# Altium project Wolf-Lite M.PrjPcb (part 1 of 2)
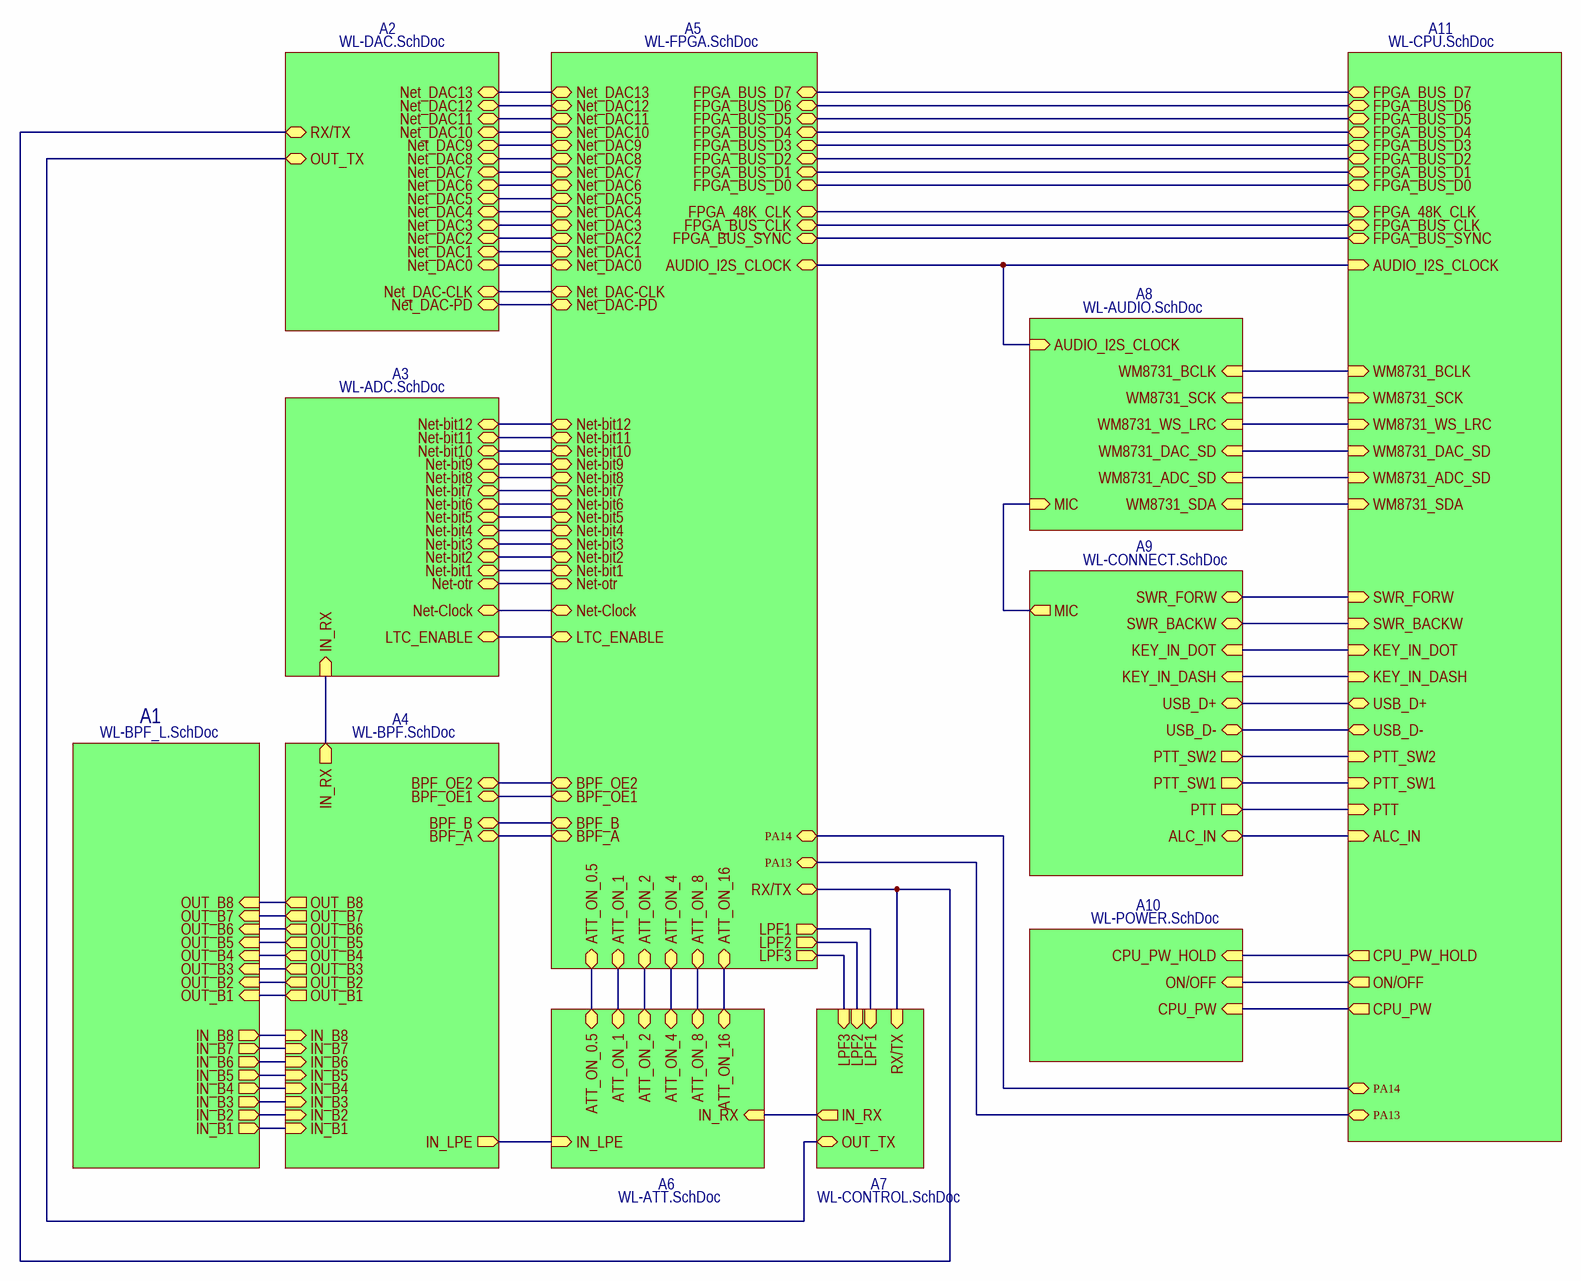
[diagram p0: WL-MAIN.SchDoc]
Обозначение_Код: WOLF LITE M; Обозначение_PCB: WOLF LITE M; Обозначение: WOLF LITE M
12 sheets, 331 parts. Net scope: hierarchical (ports join the sheet entries above them; power ports are global).
Board file: Wolf-Lite M.PcbDoc
Sheets:
  WL-MAIN.SchDoc
    A10 = WL-POWER.SchDoc
    A3 = WL-ADC.SchDoc
    A5 = WL-FPGA.SchDoc
    A2 = WL-DAC.SchDoc
    A6 = WL-ATT.SchDoc
    A11 = WL-CPU.SchDoc
    A8 = WL-AUDIO.SchDoc
    A7 = WL-CONTROL.SchDoc
    A4 = WL-BPF.SchDoc
    A9 = WL-CONNECT.SchDoc
    A1 = WL-BPF_L.SchDoc

## Sheet WL-MAIN.SchDoc
size 420 x 297 mm; Scale: 1:1; DocumentNumber: 1; SheetNumber: 1; SheetTotal: 12

### Sub-sheets
A1 = WL-BPF_L.SchDoc: OUT_B2 (in), OUT_B3 (in), OUT_B4 (in), OUT_B1 (in), IN_B1 (out), IN_B2 (out), IN_B3 (out), IN_B4 (out), OUT_B7 (in), OUT_B6 (in), OUT_B5 (in), IN_B7 (out), IN_B6 (out), IN_B5 (out), IN_B8 (out), OUT_B8 (in)
A2 = WL-DAC.SchDoc: Net_DAC13 (bidir), Net_DAC2 (bidir), Net_DAC3 (bidir), Net_DAC1 (bidir), Net_DAC0 (bidir), Net_DAC-CLK (bidir), Net_DAC4 (bidir), Net_DAC7 (bidir), Net_DAC10 (bidir), Net_DAC5 (bidir), Net_DAC6 (bidir), Net_DAC11 (bidir), Net_DAC12 (bidir), Net_DAC8 (bidir), Net_DAC9 (bidir), OUT_TX (bidir), Net_DAC-PD (bidir), RX/TX (bidir)
A3 = WL-ADC.SchDoc: Net-bit7 (bidir), Net-bit2 (bidir), Net-bit10 (bidir), Net-bit6 (bidir), Net-bit4 (bidir), Net-bit3 (bidir), Net-bit1 (bidir), Net-bit5 (bidir), Net-bit9 (bidir), Net-otr (bidir), Net-bit8 (bidir), Net-bit11 (bidir), Net-Clock (bidir), Net-bit12 (bidir), LTC_ENABLE (bidir), IN_RX (in)
A4 = WL-BPF.SchDoc: IN_RX (out), BPF_OE2 (bidir), BPF_A (bidir), BPF_B (bidir), BPF_OE1 (bidir), OUT_B8 (out), OUT_B7 (out), OUT_B6 (out), OUT_B5 (out), OUT_B4 (out), OUT_B3 (out), OUT_B2 (out), OUT_B1 (out), IN_B1 (in), IN_B2 (in), IN_B3 (in), IN_B4 (in), IN_B5 (in), IN_B6 (in), IN_B7 (in), IN_B8 (in), IN_LPE (out)
A5 = WL-FPGA.SchDoc: FPGA_BUS_D5 (bidir), FPGA_BUS_D2 (bidir), FPGA_BUS_D7 (bidir), AUDIO_I2S_CLOCK (bidir), FPGA_BUS_D4 (bidir), FPGA_BUS_D1 (bidir), FPGA_48K_CLK (bidir), FPGA_BUS_D6 (bidir), FPGA_BUS_D3 (bidir), FPGA_BUS_D0 (bidir), FPGA_BUS_CLK (bidir), FPGA_BUS_SYNC (bidir), ATT_ON_0.5 (bidir), ATT_ON_1 (bidir), ATT_ON_2 (bidir), ATT_ON_4 (bidir), ATT_ON_8 (bidir), ATT_ON_16 (bidir), Net_DAC13 (bidir), Net_DAC2 (bidir), Net_DAC3 (bidir), Net_DAC1 (bidir), Net_DAC0 (bidir), Net_DAC-CLK (bidir), Net_DAC4 (bidir), Net_DAC7 (bidir), Net_DAC10 (bidir), Net_DAC5 (bidir), Net_DAC6 (bidir), Net_DAC11 (bidir), Net_DAC12 (bidir), Net_DAC8 (bidir), Net_DAC9 (bidir), Net-bit7 (bidir), Net-bit2 (bidir), Net-bit10 (bidir), Net-bit6 (bidir), Net-bit4 (bidir), Net-bit3 (bidir), Net-bit1 (bidir), Net-bit5 (bidir), Net-bit9 (bidir), Net-otr (bidir), Net-bit8 (bidir), Net-bit11 (bidir), Net-Clock (bidir), Net-bit12 (bidir), BPF_OE2 (bidir), BPF_A (bidir), BPF_B (bidir), BPF_OE1 (bidir), LPF2 (out), LPF1 (out), LPF3 (out), Net_DAC-PD (bidir), RX/TX (bidir), LTC_ENABLE (bidir), PA14 (bidir), PA13 (bidir)
A6 = WL-ATT.SchDoc: ATT_ON_1 (bidir), ATT_ON_2 (bidir), ATT_ON_16 (bidir), ATT_ON_8 (bidir), ATT_ON_4 (bidir), ATT_ON_0.5 (bidir), IN_LPE (in), IN_RX (in)
A7 = WL-CONTROL.SchDoc: RX/TX (in), OUT_TX (bidir), IN_RX (out), LPF2 (in), LPF1 (in), LPF3 (in)
A8 = WL-AUDIO.SchDoc: MIC (in), WM8731_BCLK (in), WM8731_SCK (in), WM8731_WS_LRC (in), AUDIO_I2S_CLOCK (in), WM8731_DAC_SD (in), WM8731_ADC_SD (in), WM8731_SDA (in)
A9 = WL-CONNECT.SchDoc: USB_D- (bidir), PTT (out), MIC (out), USB_D+ (bidir), PTT_SW2 (out), PTT_SW1 (out), ALC_IN (bidir), KEY_IN_DASH (in), KEY_IN_DOT (in), SWR_FORW (bidir), SWR_BACKW (bidir)
A10 = WL-POWER.SchDoc: CPU_PW_HOLD (in), ON/OFF (in), CPU_PW (in)
A11 = WL-CPU.SchDoc: USB_D+ (bidir), USB_D- (bidir), PTT_SW2 (in), PTT_SW1 (in), PTT (in), FPGA_BUS_D5 (bidir), FPGA_BUS_D2 (bidir), FPGA_BUS_D7 (bidir), FPGA_BUS_D4 (bidir), FPGA_BUS_D1 (bidir), FPGA_48K_CLK (bidir), FPGA_BUS_D6 (bidir), FPGA_BUS_D3 (bidir), FPGA_BUS_D0 (bidir), FPGA_BUS_CLK (bidir), FPGA_BUS_SYNC (bidir), CPU_PW_HOLD (out), ON/OFF (out), CPU_PW (out), KEY_IN_DOT (in), KEY_IN_DASH (in), SWR_FORW (in), SWR_BACKW (in), ALC_IN (in), AUDIO_I2S_CLOCK (in), WM8731_SCK (in), WM8731_BCLK (in), WM8731_WS_LRC (in), WM8731_DAC_SD (in), WM8731_ADC_SD (in), WM8731_SDA (in), PA14 (bidir), PA13 (bidir)

### Nets
ALC_IN: sheet A11/ALC_IN, sheet A9/ALC_IN
ATT_ON_0.5: sheet A5/ATT_ON_0.5, sheet A6/ATT_ON_0.5
ATT_ON_1: sheet A5/ATT_ON_1, sheet A6/ATT_ON_1
ATT_ON_2: sheet A5/ATT_ON_2, sheet A6/ATT_ON_2
ATT_ON_4: sheet A5/ATT_ON_4, sheet A6/ATT_ON_4
ATT_ON_8: sheet A5/ATT_ON_8, sheet A6/ATT_ON_8
ATT_ON_16: sheet A5/ATT_ON_16, sheet A6/ATT_ON_16
AUDIO_I2S_CLOCK: sheet A5/AUDIO_I2S_CLOCK, sheet A11/AUDIO_I2S_CLOCK, sheet A8/AUDIO_I2S_CLOCK
BPF_A: sheet A5/BPF_A, sheet A4/BPF_A
BPF_B: sheet A5/BPF_B, sheet A4/BPF_B
BPF_OE1: sheet A5/BPF_OE1, sheet A4/BPF_OE1
BPF_OE2: sheet A5/BPF_OE2, sheet A4/BPF_OE2
CPU_PW: sheet A10/CPU_PW, sheet A11/CPU_PW
CPU_PW_HOLD: sheet A10/CPU_PW_HOLD, sheet A11/CPU_PW_HOLD
D_N: sheet A11/USB_D-, sheet A9/USB_D-
D_P: sheet A11/USB_D+, sheet A9/USB_D+
FPGA_48K_CLK: sheet A5/FPGA_48K_CLK, sheet A11/FPGA_48K_CLK
FPGA_BUS_CLK: sheet A5/FPGA_BUS_CLK, sheet A11/FPGA_BUS_CLK
FPGA_BUS_D0: sheet A5/FPGA_BUS_D0, sheet A11/FPGA_BUS_D0
FPGA_BUS_D1: sheet A5/FPGA_BUS_D1, sheet A11/FPGA_BUS_D1
FPGA_BUS_D2: sheet A5/FPGA_BUS_D2, sheet A11/FPGA_BUS_D2
FPGA_BUS_D3: sheet A5/FPGA_BUS_D3, sheet A11/FPGA_BUS_D3
FPGA_BUS_D4: sheet A5/FPGA_BUS_D4, sheet A11/FPGA_BUS_D4
FPGA_BUS_D5: sheet A5/FPGA_BUS_D5, sheet A11/FPGA_BUS_D5
FPGA_BUS_D6: sheet A5/FPGA_BUS_D6, sheet A11/FPGA_BUS_D6
FPGA_BUS_D7: sheet A5/FPGA_BUS_D7, sheet A11/FPGA_BUS_D7
FPGA_BUS_SYNC: sheet A5/FPGA_BUS_SYNC, sheet A11/FPGA_BUS_SYNC
IN_B1: sheet A4/IN_B1, sheet A1/IN_B1
IN_B2: sheet A4/IN_B2, sheet A1/IN_B2
IN_B3: sheet A4/IN_B3, sheet A1/IN_B3
IN_B4: sheet A4/IN_B4, sheet A1/IN_B4
IN_B5: sheet A4/IN_B5, sheet A1/IN_B5
IN_B6: sheet A4/IN_B6, sheet A1/IN_B6
IN_B7: sheet A4/IN_B7, sheet A1/IN_B7
IN_B8: sheet A4/OUT_B8, sheet A4/IN_B8, sheet A1/IN_B8, sheet A1/OUT_B8
IN_LPE: sheet A6/IN_LPE, sheet A4/IN_LPE
IN_RX: sheet A3/IN_RX, sheet A4/IN_RX
KEY_IN_DASH: sheet A11/KEY_IN_DASH, sheet A9/KEY_IN_DASH
KEY_IN_DOT: sheet A11/KEY_IN_DOT, sheet A9/KEY_IN_DOT
LPF1: sheet A5/LPF1, sheet A7/LPF1
LPF2: sheet A5/LPF2, sheet A7/LPF2
LPF3: sheet A5/LPF3, sheet A7/LPF3
LTC_ENABLE: sheet A3/LTC_ENABLE, sheet A5/LTC_ENABLE
MIC: sheet A8/MIC, sheet A9/MIC
Net-bit1: sheet A3/Net-bit1, sheet A5/Net-bit1
Net-bit2: sheet A3/Net-bit2, sheet A5/Net-bit2
Net-bit3: sheet A3/Net-bit3, sheet A5/Net-bit3
Net-bit4: sheet A3/Net-bit4, sheet A5/Net-bit4
Net-bit5: sheet A3/Net-bit5, sheet A5/Net-bit5
Net-bit6: sheet A3/Net-bit6, sheet A5/Net-bit6
Net-bit7: sheet A3/Net-bit7, sheet A5/Net-bit7
Net-bit8: sheet A3/Net-bit8, sheet A5/Net-bit8
Net-bit9: sheet A3/Net-bit9, sheet A5/Net-bit9
Net-bit10: sheet A3/Net-bit10, sheet A5/Net-bit10
Net-bit11: sheet A3/Net-bit11, sheet A5/Net-bit11
Net-bit12: sheet A3/Net-bit12, sheet A5/Net-bit12
Net-Clock: sheet A3/Net-Clock, sheet A5/Net-Clock
Net-otr: sheet A3/Net-otr, sheet A5/Net-otr
Net_DAC0: sheet A5/Net_DAC0, sheet A2/Net_DAC0
Net_DAC1: sheet A5/Net_DAC1, sheet A2/Net_DAC1
Net_DAC2: sheet A5/Net_DAC2, sheet A2/Net_DAC2
Net_DAC3: sheet A5/Net_DAC3, sheet A2/Net_DAC3
Net_DAC4: sheet A5/Net_DAC4, sheet A2/Net_DAC4
Net_DAC5: sheet A5/Net_DAC5, sheet A2/Net_DAC5
Net_DAC6: sheet A5/Net_DAC6, sheet A2/Net_DAC6
Net_DAC7: sheet A5/Net_DAC7, sheet A2/Net_DAC7
Net_DAC8: sheet A5/Net_DAC8, sheet A2/Net_DAC8
Net_DAC9: sheet A5/Net_DAC9, sheet A2/Net_DAC9
Net_DAC10: sheet A5/Net_DAC10, sheet A2/Net_DAC10
Net_DAC11: sheet A5/Net_DAC11, sheet A2/Net_DAC11
Net_DAC12: sheet A5/Net_DAC12, sheet A2/Net_DAC12
Net_DAC13: sheet A5/Net_DAC13, sheet A2/Net_DAC13
Net_DAC-CLK: sheet A5/Net_DAC-CLK, sheet A2/Net_DAC-CLK
Net_DAC-PD: sheet A5/Net_DAC-PD, sheet A2/Net_DAC-PD
ON/OFF: sheet A10/ON/OFF, sheet A11/ON/OFF
OUT_B1: sheet A4/OUT_B1, sheet A1/OUT_B1
OUT_B2: sheet A4/OUT_B2, sheet A1/OUT_B2
OUT_B3: sheet A4/OUT_B3, sheet A1/OUT_B3
OUT_B4: sheet A4/OUT_B4, sheet A1/OUT_B4
OUT_B5: sheet A4/OUT_B5, sheet A1/OUT_B5
OUT_B6: sheet A4/OUT_B6, sheet A1/OUT_B6
OUT_B7: sheet A4/OUT_B7, sheet A1/OUT_B7
PA13: sheet A5/PA13, sheet A11/PA13
PA14: sheet A5/PA14, sheet A11/PA14
PTT: sheet A11/PTT, sheet A9/PTT
PTT_SW1: sheet A11/PTT_SW1, sheet A9/PTT_SW1
PTT_SW2: sheet A11/PTT_SW2, sheet A9/PTT_SW2
RX/TX: sheet A5/RX/TX, sheet A2/RX/TX, sheet A7/RX/TX
SWR_BACKW: sheet A11/SWR_BACKW, sheet A9/SWR_BACKW
SWR_FORW: sheet A11/SWR_FORW, sheet A9/SWR_FORW
WM8731_ADC_SD: sheet A11/WM8731_ADC_SD, sheet A8/WM8731_ADC_SD
WM8731_BCLK: sheet A11/WM8731_BCLK, sheet A8/WM8731_BCLK
WM8731_DAC_SD: sheet A11/WM8731_DAC_SD, sheet A8/WM8731_DAC_SD
WM8731_SCK: sheet A11/WM8731_SCK, sheet A8/WM8731_SCK
WM8731_SDA: sheet A11/WM8731_SDA, sheet A8/WM8731_SDA
WM8731_WS_LRC: sheet A11/WM8731_WS_LRC, sheet A8/WM8731_WS_LRC
NetC131_1: sheet A6/IN_RX, sheet A7/IN_RX
NetT4_3: sheet A2/OUT_TX, sheet A7/OUT_TX

### Notes on the sheet
- Перв. примен.
- Справ. №
- Подп. дата
- Инв. № дубл.
- Взам. инв. №
- Подп. и дата
- Изм.
- Разраб.
- Лист
- № докум.
- Подп.
- Дата
- Лит.
- Масса
- Масштаб
- Пров.
- Т.контр.
- Листов
- Инв. № подл.
- Н.контр.
- Утв.
- UT2CW LAB
- ALTIUM GOSTBOM2.0 KEV
- Файл:
- Копировал
- Формат А3

## Sheet WL-POWER.SchDoc
size 420 x 297 mm; Scale: 1:1; DocumentType: Схема электрическая принципиальная; FirstReferrence: UA3REO/R7KBI; DocumentNumber: 8; SheetNumber: 8; SheetTotal: 12
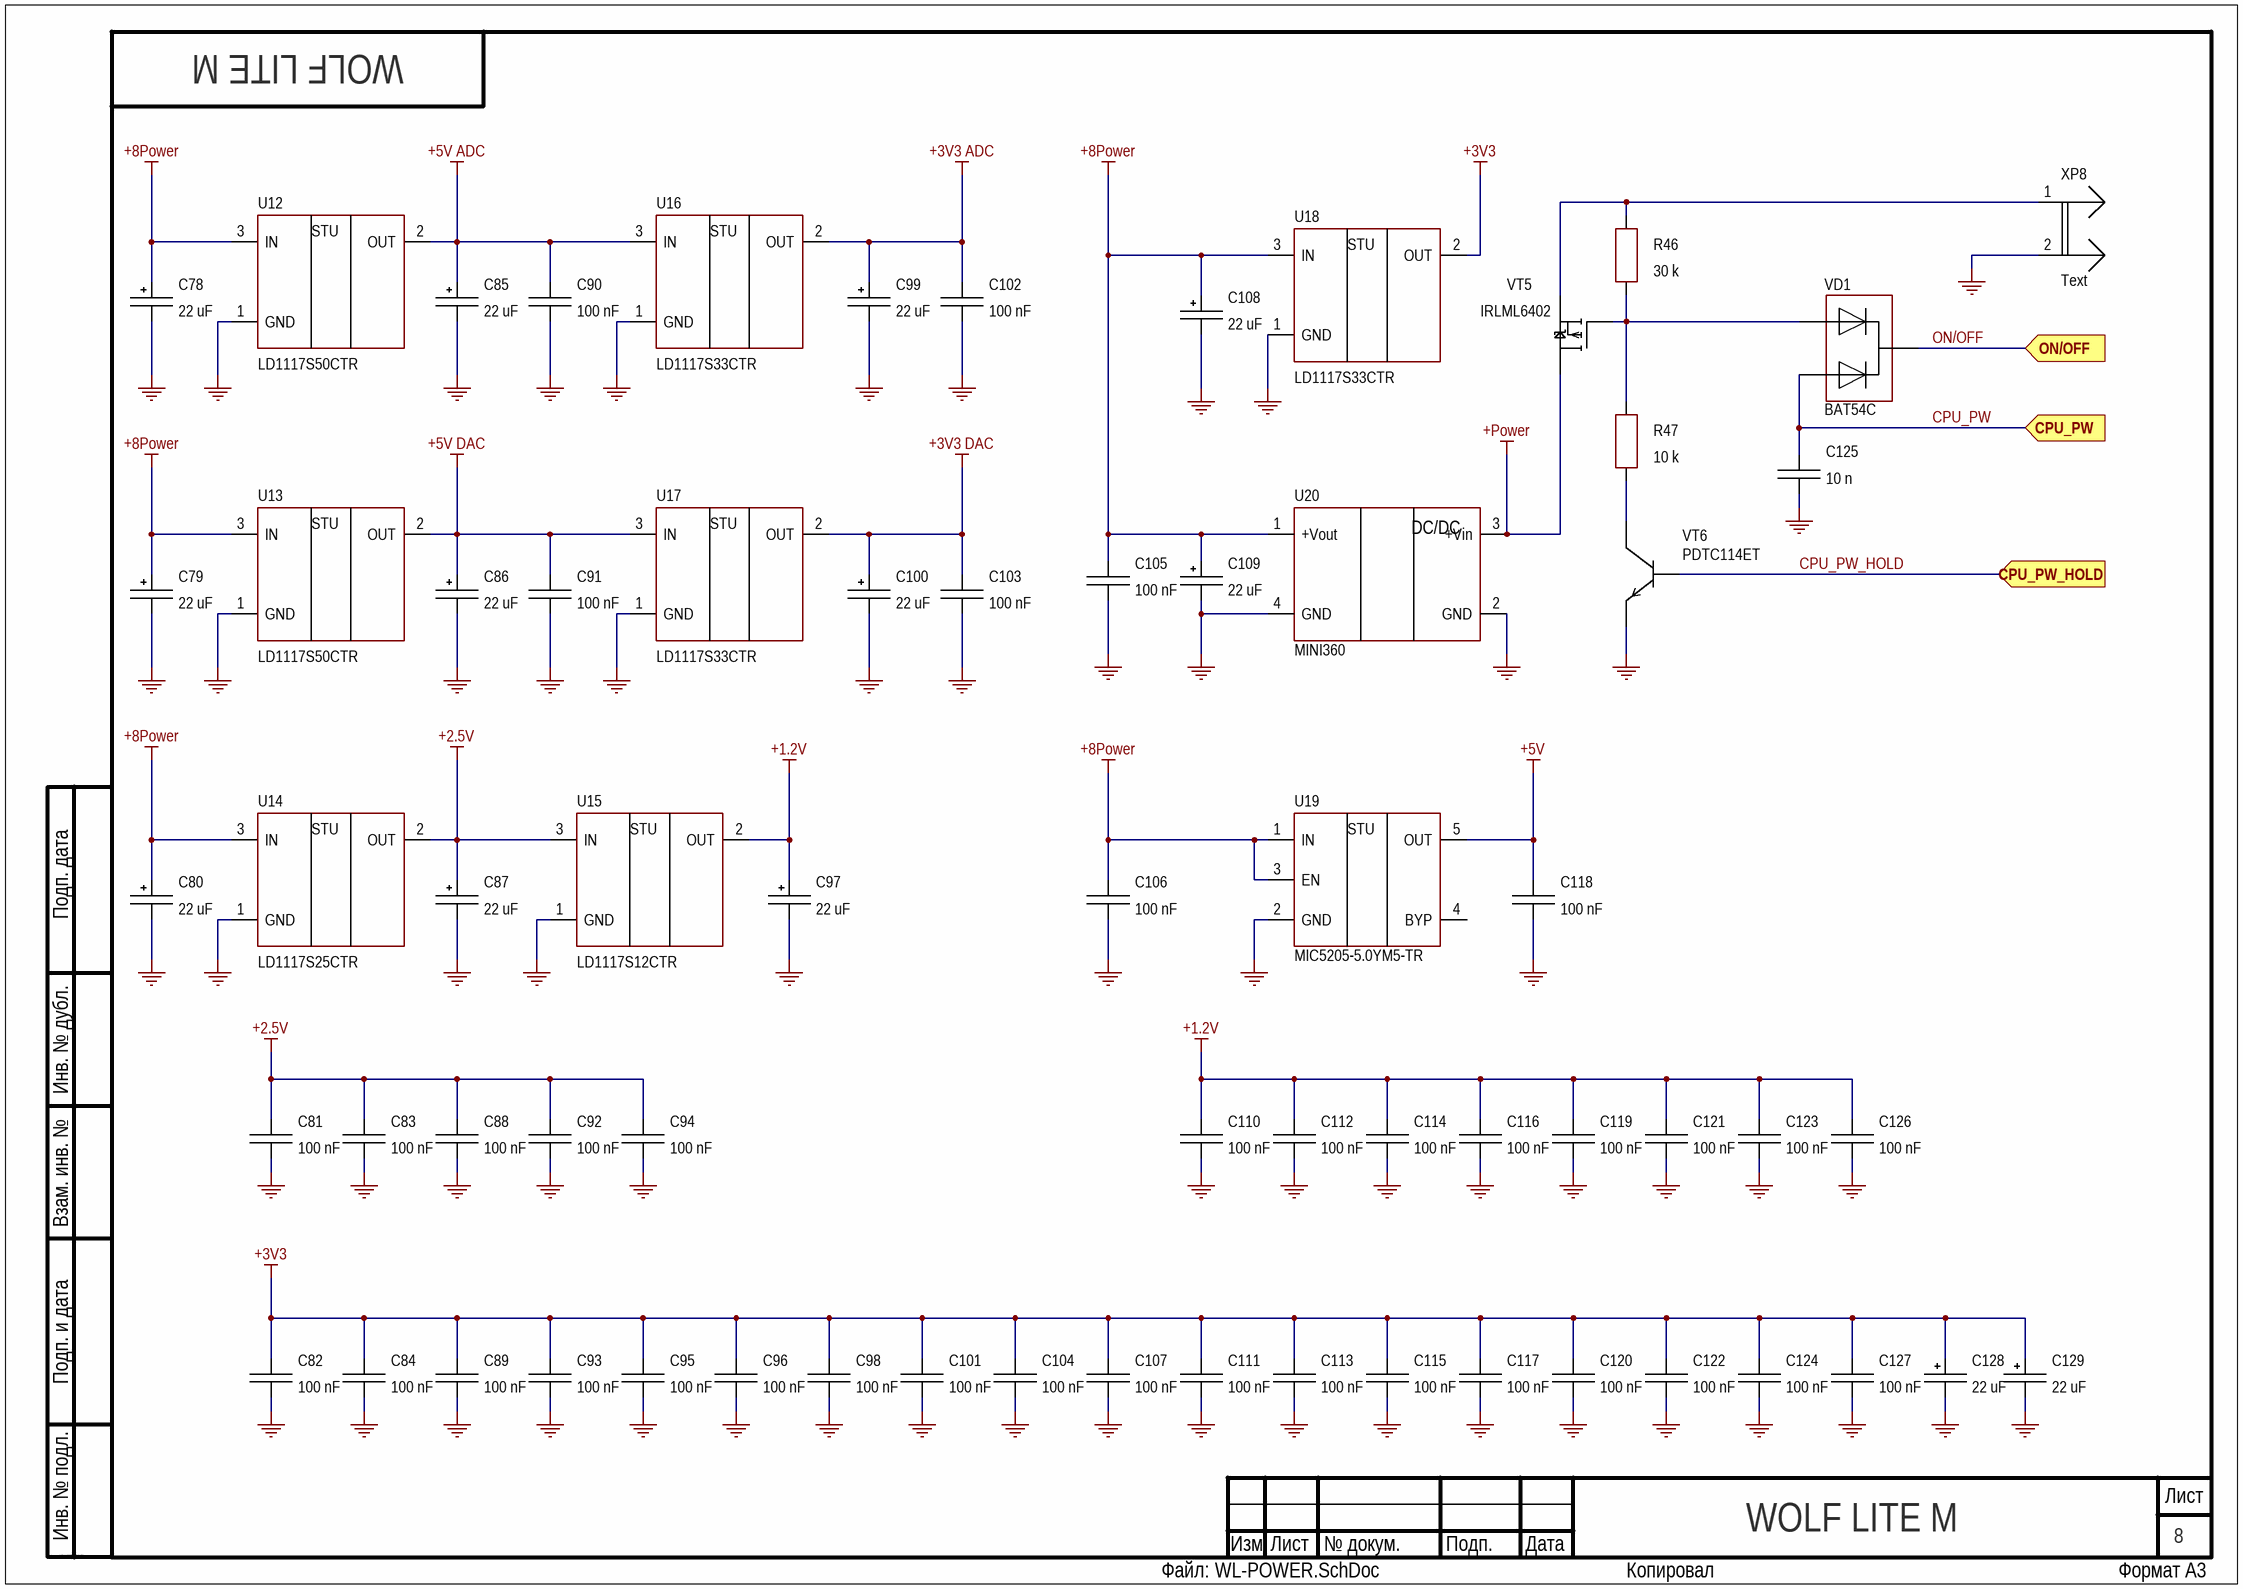
[diagram p1: WL-POWER.SchDoc]

### Parts
C78  22 uF  [CAP-CASE B]
C79  22 uF  [CAP-CASE B]
C80  22 uF  [CAP-CASE B]
C81  100 nF  [C-0805-0.95]
C82  100 nF  [C-0805-0.95]
C83  100 nF  [C-0805-0.95]
C84  100 nF  [C-0805-0.95]
C85  22 uF  [CAP-CASE B]
C86  22 uF  [CAP-CASE B]
C87  22 uF  [CAP-CASE B]
C88  100 nF  [C-0805-0.95]
C89  100 nF  [C-0805-0.95]
C90  100 nF  [C-0805-0.95]
C91  100 nF  [C-0805-0.95]
C92  100 nF  [C-0805-0.95]
C93  100 nF  [C-0805-0.95]
C94  100 nF  [C-0805-0.95]
C95  100 nF  [C-0805-0.95]
C96  100 nF  [C-0805-0.95]
C97  22 uF  [CAP-CASE B]
C98  100 nF  [C-0805-0.95]
C99  22 uF  [CAP-CASE B]
C100  22 uF  [CAP-CASE B]
C101  100 nF  [C-0805-0.95]
C102  100 nF  [C-0805-0.95]
C103  100 nF  [C-0805-0.95]
C104  100 nF  [C-0805-0.95]
C105  100 nF  [C-0805-0.95]
C106  100 nF  [C-0805-0.95]
C107  100 nF  [C-0805-0.95]
C108  22 uF  [CAP-CASE B]
C109  22 uF  [CAP-CASE B]
C110  100 nF  [C-0805-0.95]
C111  100 nF  [C-0805-0.95]
C112  100 nF  [C-0805-0.95]
C113  100 nF  [C-0805-0.95]
C114  100 nF  [C-0805-0.95]
C115  100 nF  [C-0805-0.95]
C116  100 nF  [C-0805-0.95]
C117  100 nF  [C-0805-0.95]
C118  100 nF  [C-0805-0.95]
C119  100 nF  [C-0805-0.95]
C120  100 nF  [C-0805-0.95]
C121  100 nF  [C-0805-0.95]
C122  100 nF  [C-0805-0.95]
C123  100 nF  [C-0805-0.95]
C124  100 nF  [C-0805-0.95]
C125  10 n  [C-0805-0.7]
C126  100 nF  [C-0805-0.95]
C127  100 nF  [C-0805-0.95]
C128  22 uF  [CAP-CASE B]
C129  22 uF  [CAP-CASE B]
R46  30 k  [R-0805]
R47  10 k  [R-0805]
U12  LD1117S50CTR  [SOT-223]
U13  LD1117S50CTR  [SOT-223]
U14  LD1117S25CTR  [SOT-223]
U15  LD1117S12CTR  [SOT-223]
U16  LD1117S33CTR  [SOT-223]
U17  LD1117S33CTR  [SOT-223]
U18  LD1117S33CTR  [SOT-223]
U19  MIC5205-5.0YM5-TR  [SOT-23-5]
U20  MINI360  [MINI360]
VD1  BAT54C  [SOT-23]
VT5  IRLML6402  [SOT-23]
VT6  PDTC114ET  [SOT-23]
XP8  Text  [61900211121]

### Ports
CPU_PW (in), CPU_PW_HOLD (in), ON/OFF (in)

### Nets
+1.2V: C97.1 C110.1 C112.1 C114.1 C116.1 C119.1 C121.1 C123.1 C126.1 U15.2(OUT)
+2.5V: C81.1 C83.1 C87.1 C88.1 C92.1 C94.1 U14.2(OUT) U15.3(IN)
+3V3: C82.1 C84.1 C89.1 C93.1 C95.1 C96.1 C98.1 C101.1 C104.1 C107.1 C111.1 C113.1 C115.1 C117.1 C120.1 C122.1 C124.1 C127.1 C128.1 C129.1 U18.2(OUT)
+3V3 ADC: C99.1 C102.2 U16.2(OUT)
+3V3 DAC: C100.1 C103.2 U17.2(OUT)
+5V: C118.1 U19.5(OUT)
+5V ADC: C85.1 C90.2 U12.2(OUT) U16.3(IN)
+5V DAC: C86.1 C91.2 U13.2(OUT) U17.3(IN)
+8Power: C78.1 C79.1 C80.1 C105.2 C106.1 C108.1 C109.1 U12.3(IN) U13.3(IN) U14.3(IN) U18.3(IN) U19.1(IN) U19.3(EN) U20.1(+Vout)
+Power: U20.3(+Vin) VT5.3(D)
GND: C78.2 C79.2 C80.2 C81.2 C82.2 C83.2 C84.2 C85.2 C86.2 C87.2 C88.2 C89.2 C90.1 C91.1 C92.2 C93.2 C94.2 C95.2 C96.2 C97.2 C98.2 C99.2 C100.2 C101.2 C102.1 C103.1 C104.2 C105.1 C106.2 C107.2 C108.2 C109.2 C110.2 C111.2 C112.2 C113.2 C114.2 C115.2 C116.2 C117.2 C118.2 C119.2 C120.2 C121.2 C122.2 C123.2 C124.2 C125.2 C126.2 C127.2 C128.2 C129.2 U12.1(GND) U13.1(GND) U14.1(GND) U15.1(GND) U16.1(GND) U17.1(GND) U18.1(GND) U19.2(GND) U20.2(GND) U20.4(GND) VT6.2 XP8.2
CPU_PW: C125.1 VD1.2 ; port CPU_PW
CPU_PW_HOLD: VT6.1 ; port CPU_PW_HOLD
ON/OFF: VD1.3 ; port ON/OFF
NetR46_1: R46.1 R47.1 VD1.1 VT5.1(G)
NetR46_2: R46.2 VT5.2(S) XP8.1
NetR47_2: R47.2 VT6.3

Not connected (* = marked no-connect by the designer): U19 4(BYP)

### Notes on the sheet
- Подп. дата
- Инв. № дубл.
- Взам. инв. №
- Подп. и дата
- Инв. № подл.
- Изм.
- Лист
- № докум.
- Подп.
- Дата
- ALTIUM GOSTBOM2.0 KEV
- Файл:
- Копировал
- Формат А3
- (in symbol LD1117S12CTR) STU
- (in symbol LD1117S25CTR) STU
- (in symbol LD1117S33CTR) STU
- (in symbol LD1117S50CTR) STU
- (in symbol MIC5205-5.0YM5-TR) STU

### Library data of the parts
C78-C80 C85-C87 C97 C99 C100 C108 C109 C128 C129 = EEE-1CA220WAR: Manufacturer: Panasonic Electronic Components; Type: Конденсатор; Value: 22; Tolerance: ±20%; Voltage: 16 V; CommentDOC: ( S - 16 V - 22  uF  ±20% ); Part Number: EEE-1CA220WAR; Units: uF; Case: 4x5.4; Operating Temperature: -40 ... 85 °C; Series: S; ValueSCH: 22 uF; ( Series - Voltage - Value  Units  Tolerance ): ( S - 16 V - 22  uF  ±20% )
C81-C84 C88-C96 C98 C101-C107 C110-C124 C126 C127 = CC0805KRX7R9BB104: Manufacturer: Yageo; Value: 100; Type: Конденсатор; Dielectric: X7R; Tolerance: ±10%; Voltage: 50 V; CommentDOC: ( CC - 0805 - X7R - 50 V - 100 nF ±10% ); Part Number: CC0805KRX7R9BB104; Units: nF; Case: 0805; Operating Temperature: -55 ... 125 °C; Series: CC; Value+Units: 100 nF; ValueSCH: 100 nF; ( Series - Case - Dielectric -  Voltage - Value+Units Tolerance: ( CC - 0805 - X7R - 50 V - 100 nF ±10% )
C125 = CC0805KRX7R9BB103: Manufacturer: Yageo; Value: 10; Type: Конденсатор; Dielectric: X7R; Units: nF; Tolerance: ±10%; Voltage: 50 V; Value+Units: 10 nF; CommentDOC: ( CC - 0805 - X7R - 50 V - 10 nF ±10% ); Part Number: CC0805KRX7R9BB103; Case: 0805; Operating Temperature: -55 ... 125 °C; Series: CC; ValueSCH: 10 n; ( Series - Case - Dielectric -  Voltage - Value+Units Tolerance: ( CC - 0805 - X7R - 50 V - 10 nF ±10% )
R46 = RC0805JR-0730KL: Manufacturer: Yageo; Value: 30; Power: 0,125 W; Units: kOhm; Tolerance: ±5%; Operating Voltage: 150 V; Value+Units: 30 kOhm; CommentDOC: ( RC - 0805 - 0,125 W - 30 kOhm  ±5% ); Type: Резистор; Part Number: RC0805JR-0730KL; Case: 0805; Operating Temperature: -55°C ... 155°C; ValueSCH: 30 k; Series: RC
R47 = RC0805JR-0710KL: Manufacturer: Yageo; Value: 10; Power: 0,125 W; Units: kOhm; Tolerance: ±5%; Operating Voltage: 150 V; Value+Units: 10 kOhm; CommentDOC: ( RC - 0805 - 0,125 W - 10 kOhm  ±5% ); Type: Резистор; Part Number: RC0805JR-0710KL; Case: 0805; Operating Temperature: -55°C ... 155°C; ValueSCH: 10 k; Series: RC
U12 U13 = LD1117S50CTR: IC REG LINEAR; Manufacturer: STMicroelectronics; Voltage Output: 5,0 V; Current Output Max: 800 mA; Voltage Input Max: 15 V; Type: Микросхема; Part Number: LD1117S50CTR; ValueSCH: LD1117S50CTR; Case: SOT-223; Operating Temperature: −40°C ... 125°C
U14 = LD1117S25CTR: IC REG LINEAR; Manufacturer: STMicroelectronics; Voltage Output: 2,5 V; Current Output Max: 800 mA; Voltage Input Max: 15 V; Type: Микросхема; Part Number: LD1117S25CTR; ValueSCH: LD1117S25CTR; Case: SOT-223; Operating Temperature: −40°C ... 125°C
U15 = LD1117S12CTR: IC REG LINEAR; Manufacturer: STMicroelectronics; Voltage Output: 1,2 V; Current Output Max: 800 mA; Voltage Input Max: 15 V; Type: Микросхема; Part Number: LD1117S12CTR; ValueSCH: LD1117S12CTR; Case: SOT-223; Operating Temperature: −40°C ... 125°C
U16-U18 = LD1117S33CTR: IC REG LINEAR; Manufacturer: STMicroelectronics; Voltage Output: 3,3 V; Current Output Max: 800 mA; Voltage Input Max: 15 V; Type: Микросхема; Part Number: LD1117S33CTR; ValueSCH: LD1117S33CTR; Case: SOT-223; Operating Temperature: −40°C ... 125°C
U19 = MIC5205-5.0YM5-TR: IC REG LINEAR  150MA SOT-23-5; Manufacturer: Microchip Technology; Voltage Output: 5,0 V; Voltage Input Max: 16 V; Type: Микросхема; Part Number: MIC5205-5.0YM5-TR; ValueSCH: MIC5205-5.0YM5-TR; Current Output Max: 150 mA; Case: SOT-23-5; Operating Temperature: −40°C ... 125°C
U20 = MINI360: DC/DC; Type: Модуль питания; Part Number: MINI360; ValueSCH: MINI360
VD1 = BAT54CLT3G: Manufacturer: ON Semiconductor; Type: Диод; Voltage Revers: 30 V; Current: 200 mA; Part Number: BAT54CLT3G; ValueSCH: BAT54C; Case: SOT-23; Operating Temperature: -40°С ... 150°С
VT5 = IRLML6402TRPBF: Manufacturer: Infineon Technologies; Type: Транзистор; D-S Voltage max: 20 V; Drain Current max: 3,7 A; Total Power Dissipation: 1,3 W; Rds On (Max): 65 mOhm; Vgs (Max): ±12 V; Gate Threshold Voltage: 1,2 V; Input Capacitance: 633 pF; Part Number: IRLML6402TRPBF; ValueSCH: IRLML6402; Operating Temperature: -55°C ... 150°C
VT6 = PDTC114ET,215: Manufacturer: Nexperia USA Inc.; Type: Транзистор; Total Power Dissipation: 250 mW; Uce max: 50 V; Ice max: 100 mA; F max: 230 MHz; Part Number: PDTC114ET,215; ValueSCH: PDTC114ET; Operating Temperature: -65°C …  150°C; DC Current Gain: -
XP8 = 61900211121: Manufacturer: Würth Elektronik; Pitch: 2,54 mm; Functional Analog: WF-2; Type: Вилка; Part Number: 61900211121; Series: WE-WTB; Number of Pins: 2; Operating Temperature: −40°C ... 105°C

## Sheet WL-ADC.SchDoc
size 420 x 297 mm; Scale: 1:1; DocumentType: Схема электрическая принципиальная; FirstReferrence: UA3REO/R7KBI; DocumentNumber: 4; SheetNumber: 4; SheetTotal: 12
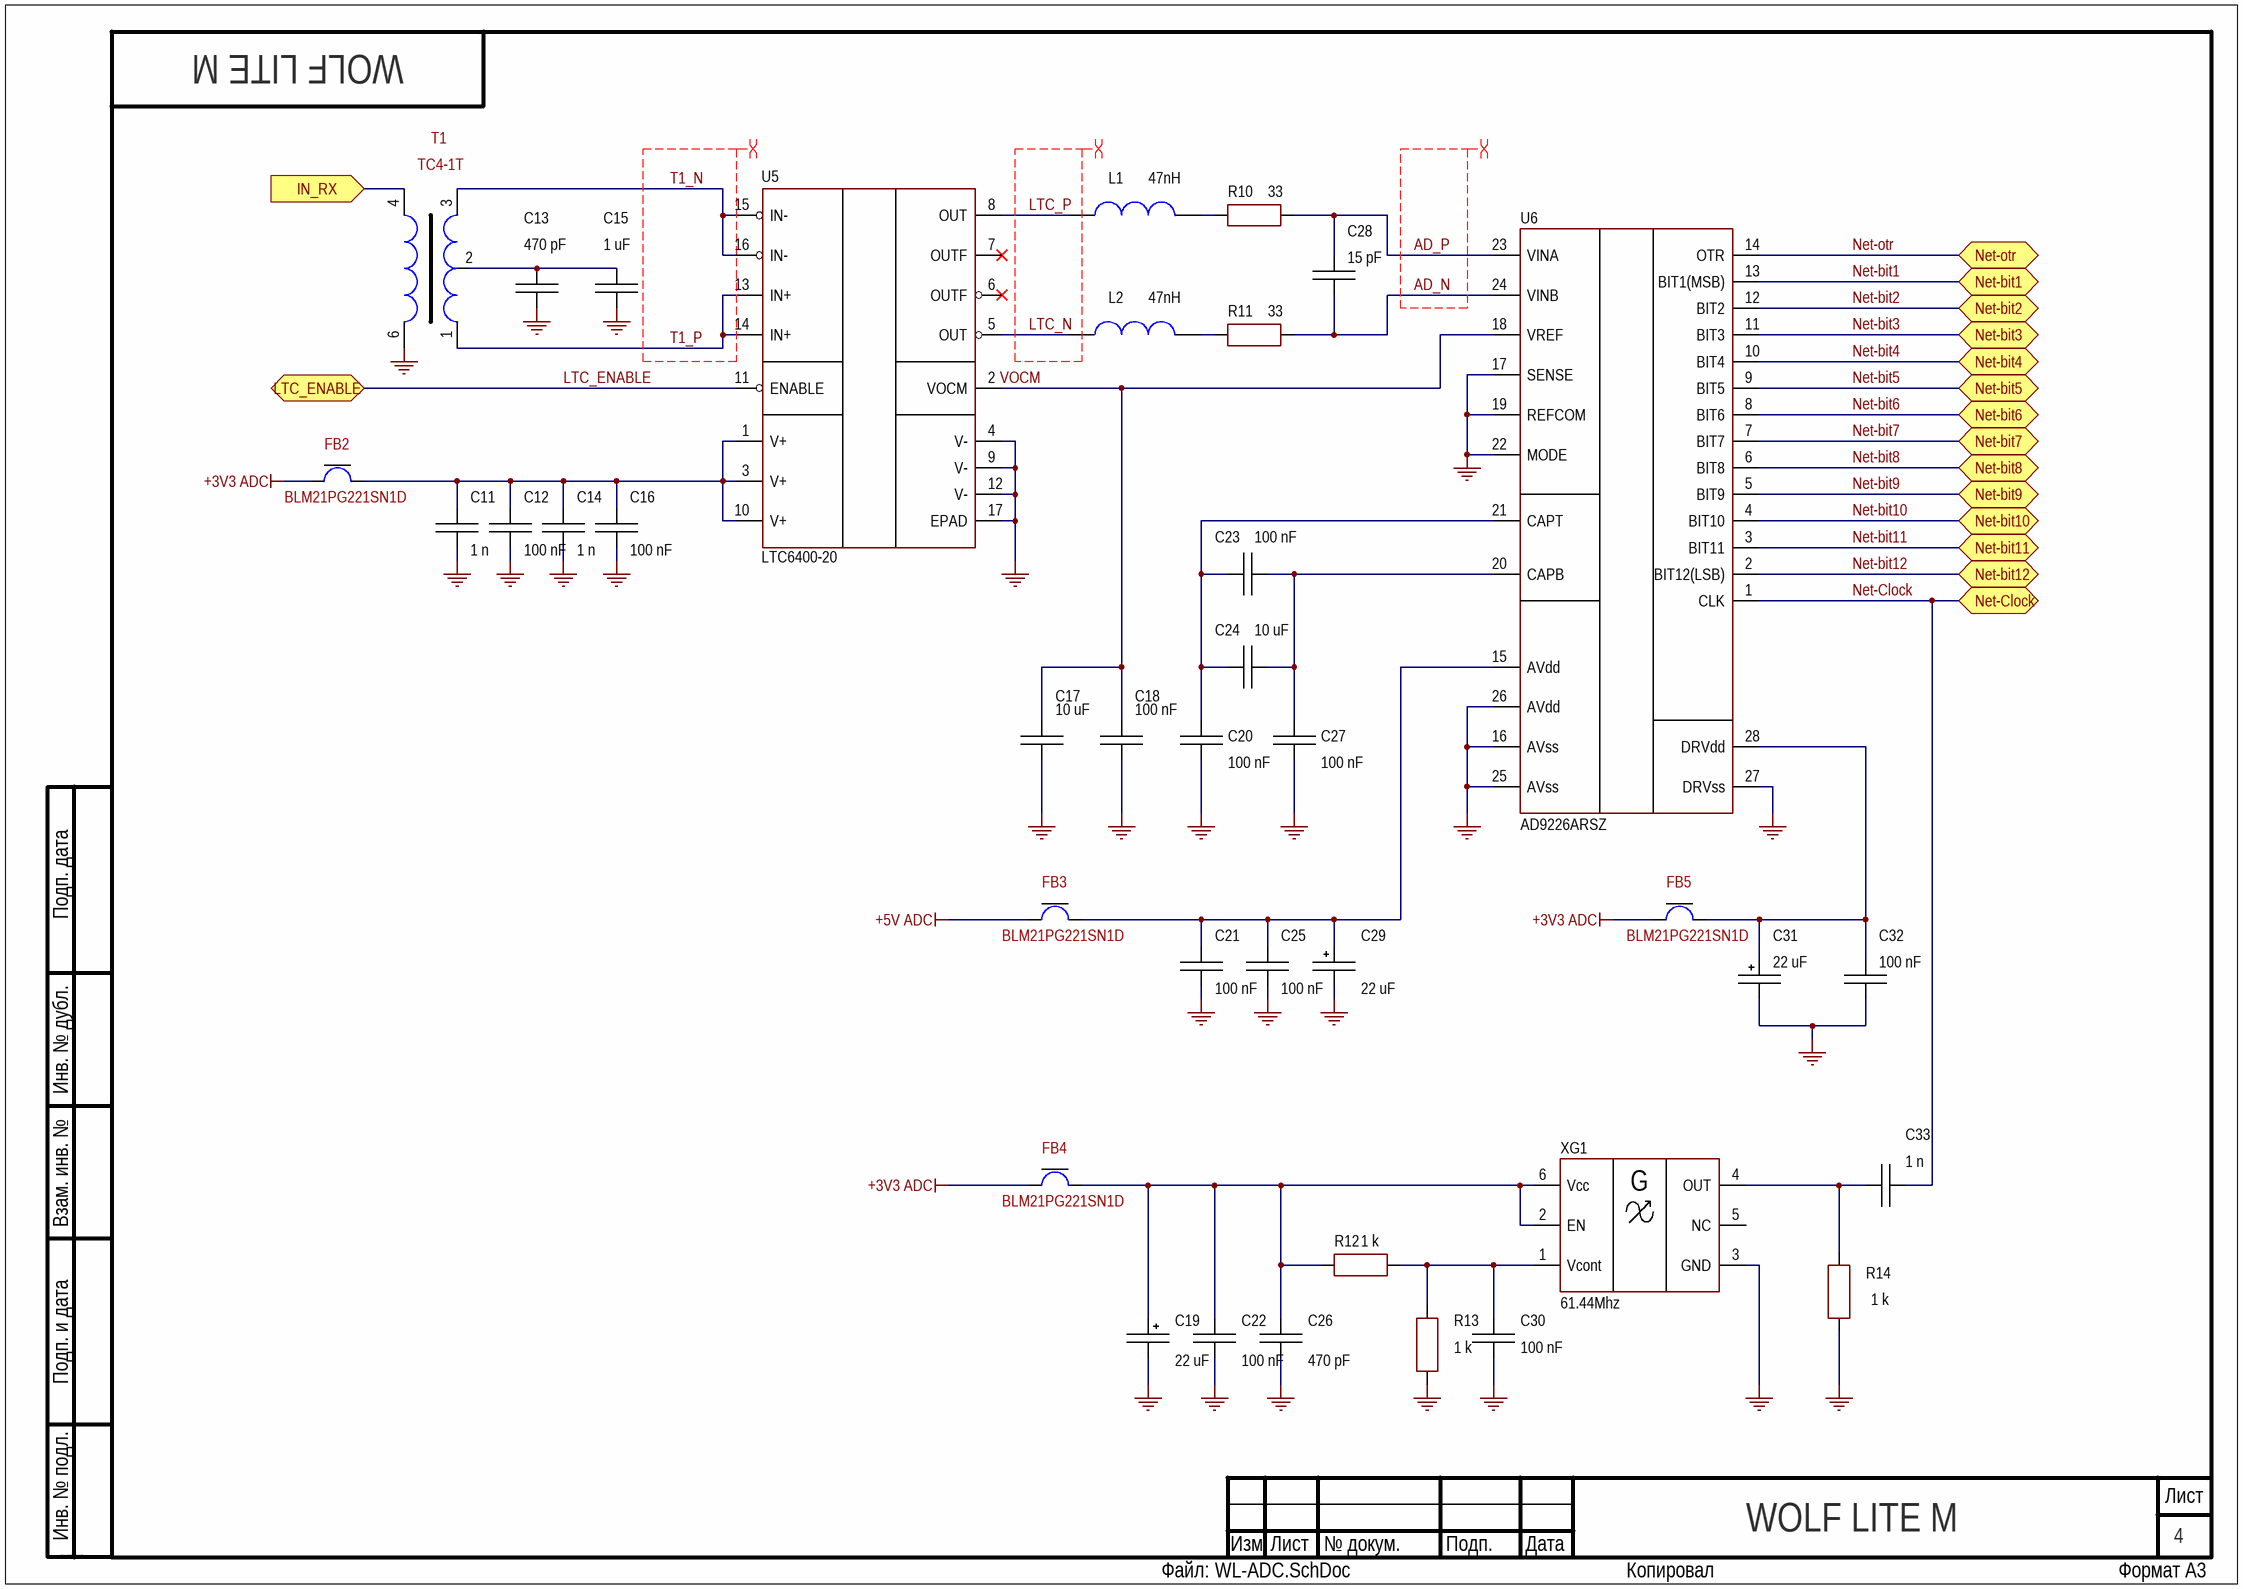
[diagram p2: WL-ADC.SchDoc]

### Parts
C11  1 n  [C-0805-0.7]
C12  100 nF  [C-0805-0.95]
C13  470 pF  [C-0805-0.7]
C14  1 n  [C-0805-0.7]
C15  1 uF  [C-0805-1.25]
C16  100 nF  [C-0805-0.95]
C17  10 uF  [C-0805-1.25]
C18  100 nF  [C-0805-0.95]
C19  22 uF  [CAP-CASE B]
C20  100 nF  [C-0805-0.95]
C21  100 nF  [C-0805-0.95]
C22  100 nF  [C-0805-0.95]
C23  100 nF  [C-0805-0.95]
C24  10 uF  [C-0805-1.25]
C25  100 nF  [C-0805-0.95]
C26  470 pF  [C-0805-0.7]
C27  100 nF  [C-0805-0.95]
C28  15 pF  [C-0805-0.7]
C29  22 uF  [CAP-CASE B]
C30  100 nF  [C-0805-0.95]
C31  22 uF  [CAP-CASE B]
C32  100 nF  [C-0805-0.95]
C33  1 n  [C-0805-0.7]
FB2  BLM21PG221SN1D  [L-0805]
FB3  BLM21PG221SN1D  [L-0805]
FB4  BLM21PG221SN1D  [L-0805]
FB5  BLM21PG221SN1D  [L-0805]
L1  47nH  [L-1210]
L2  47nH  [L-1210]
R10  33  [R-0805]
R11  33  [R-0805]
R12  1 k  [R-0805]
R13  1 k  [R-0805]
R14  1 k  [R-0805]
T1  TC4-1T  [TC4-1T]
U5  LTC6400-20  [EQFN-16]
U6  AD9226ARSZ  [SSOP-28]
XG1  61.44Mhz  [VCXO]

### Ports
IN_RX (in), LTC_ENABLE (bidir), Net-bit1 (bidir), Net-bit2 (bidir), Net-bit3 (bidir), Net-bit4 (bidir), Net-bit5 (bidir), Net-bit6 (bidir), Net-bit7 (bidir), Net-bit8 (bidir), Net-bit9 (bidir), Net-bit10 (bidir), Net-bit11 (bidir), Net-bit12 (bidir), Net-Clock (bidir), Net-otr (bidir)

### Nets
+3V3 ADC: FB2.1 FB4.2 FB5.1
+5V ADC: FB3.1
GND: C11.1 C12.1 C13.2 C14.1 C15.1 C16.1 C17.2 C18.1 C19.2 C20.1 C21.1 C22.2 C25.1 C26.2 C27.1 C29.2 C30.2 C31.2 C32.1 R13.2 R14.1 T1.6 U5.4(V-) U5.9(V-) U5.12(V-) U5.17(EPAD) U6.16(AVss) U6.17(SENSE) U6.19(REFCOM) U6.22(MODE) U6.25(AVss) U6.26(AVdd) U6.27(DRVss) XG1.3(GND)
AD_N: C28.1 R11.2 U6.24(VINB)
AD_P: C28.2 R10.2 U6.23(VINA)
IN_RX: T1.4 ; port IN_RX
LTC_ENABLE: U5.11(ENABLE) ; port LTC_ENABLE
LTC_N: L2.1 U5.5(OUT)
LTC_P: L1.1 U5.8(OUT)
Net-bit1: U6.13(BIT1(MSB)) ; port Net-bit1
Net-bit2: U6.12(BIT2) ; port Net-bit2
Net-bit3: U6.11(BIT3) ; port Net-bit3
Net-bit4: U6.10(BIT4) ; port Net-bit4
Net-bit5: U6.9(BIT5) ; port Net-bit5
Net-bit6: U6.8(BIT6) ; port Net-bit6
Net-bit7: U6.7(BIT7) ; port Net-bit7
Net-bit8: U6.6(BIT8) ; port Net-bit8
Net-bit9: U6.5(BIT9) ; port Net-bit9
Net-bit10: U6.4(BIT10) ; port Net-bit10
Net-bit11: U6.3(BIT11) ; port Net-bit11
Net-bit12: U6.2(BIT12(LSB)) ; port Net-bit12
Net-Clock: C33.2 U6.1(CLK) ; port Net-Clock
Net-otr: U6.14(OTR) ; port Net-otr
T1_N: T1.3 U5.15(IN-) U5.16(IN-)
T1_P: T1.1 U5.13(IN+) U5.14(IN+)
VOCM: C17.1 C18.2 U5.2(VOCM) U6.18(VREF)
NetC11_2: C11.2 C12.2 C14.2 C16.2 FB2.2 U5.1(V+) U5.3(V+) U5.10(V+)
NetC13_1: C13.1 C15.2 T1.2
NetC19_1: C19.1 C22.1 C26.1 FB4.1 R12.1 XG1.2(EN) XG1.6(Vcc)
NetC20_2: C20.2 C23.1 C24.1 U6.21(CAPT)
NetC21_2: C21.2 C25.2 C29.1 FB3.2 U6.15(AVdd)
NetC23_2: C23.2 C24.2 C27.2 U6.20(CAPB)
NetC30_1: C30.1 R12.2 R13.1 XG1.1(Vcont)
NetC31_1: C31.1 C32.2 FB5.2 U6.28(DRVdd)
NetC33_1: C33.1 R14.2 XG1.4(OUT)
NetL1_2: L1.2 R10.1
NetL2_2: L2.2 R11.1

Not connected (* = marked no-connect by the designer): U5 6(OUTF)* 7(OUTF)*; XG1 5(NC)

### Layout directives
differential pair: AD_N, AD_P, LTC_N, LTC_P, T1_N, T1_P

### Notes on the sheet
- Подп. дата
- Инв. № дубл.
- Взам. инв. №
- Подп. и дата
- Инв. № подл.
- Изм.
- Лист
- № докум.
- Подп.
- Дата
- ALTIUM GOSTBOM2.0 KEV
- Файл:
- Копировал
- Формат А3
- (in symbol VCXO) G

### Library data of the parts
C11 C14 C33 = CC0805JRNPO9BN102: Manufacturer: Yageo; Value: 1; Type: Конденсатор; Dielectric: NPO; Units: nF; Tolerance: ±5%; Voltage: 50 V; Value+Units: 1 nF; CommentDOC: ( CC - 0805 - NPO - 50 V - 1 nF ±5% ); Part Number: CC0805JRNPO9BN102; Case: 0805; Operating Temperature: -55 ... 125 °C; Series: CC; ValueSCH: 1 n; ( Series - Case - Dielectric -  Voltage - Value+Units Tolerance: ( CC - 0805 - NPO - 50 V - 1 nF ±5% )
C12 C16 C18 C20-C23 C25 C27 C30 C32 = CC0805KRX7R9BB104: as C81 on sheet WL-POWER; Part Number: CC0805KRX7R9BB104; Units: nF; Case: 0805; Operating Temperature: -55 ... 125 °C; Series: CC; Value+Units: 100 nF; ValueSCH: 100 nF; ( Series - Case - Dielectric -  Voltage - Value+Units Tolerance: ( CC - 0805 - X7R - 50 V - 100 nF ±10% )
C13 C26 = CC0805JRNPO9BN471: Manufacturer: Yageo; Value: 470; Type: Конденсатор; Dielectric: NPO; Tolerance: ±5%; Voltage: 50 V; CommentDOC: ( CC - 0805 - NPO - 50 V - 470 pF ±5% ); Part Number: CC0805JRNPO9BN471; Units: pF; Case: 0805; Operating Temperature: -55 ... 125 °C; Series: CC; Value+Units: 470 pF; ValueSCH: 470 pF; ( Series - Case - Dielectric -  Voltage - Value+Units Tolerance: ( CC - 0805 - NPO - 50 V - 470 pF ±5% )
C15 = CC0805KKX7R9BB105: Manufacturer: Yageo; Value: 1; Type: Конденсатор; Dielectric: X7R; Tolerance: ±10%; Voltage: 50 V; CommentDOC: ( CC - 0805 - X7R - 50 V - 1 uF ±10% ); Part Number: CC0805KKX7R9BB105; Units: uF; Case: 0805; Operating Temperature: -55 ... 125 °C; Series: CC; Value+Units: 1 uF; ValueSCH: 1 uF; ( Series - Case - Dielectric -  Voltage - Value+Units Tolerance: ( CC - 0805 - X7R - 50 V - 1 uF ±10% )
C17 C24 = CL21B106KOQNNNE: Manufacturer: Samsung Electro-Mechanics; Value: 10; Type: Конденсатор; Dielectric: X7R; Tolerance: ±10%; Voltage: 16 V; CommentDOC: ( CL - 0805 - X7R - 16 V - 10 uF ±10% ); Part Number: CL21B106KOQNNNE; Units: uF; Case: 0805; Operating Temperature: -55 ... 125 °C; Series: CL; Value+Units: 10 uF; ValueSCH: 10 uF; ( Series - Case - Dielectric -  Voltage - Value+Units Tolerance: ( CL - 0805 - X7R - 16 V - 10 uF ±10% )
C19 C29 C31 = EEE-1CA220WAR: as C78 on sheet WL-POWER; Part Number: EEE-1CA220WAR; Units: uF; Case: 4x5.4; Operating Temperature: -40 ... 85 °C; Series: S; ValueSCH: 22 uF; ( Series - Voltage - Value  Units  Tolerance ): ( S - 16 V - 22  uF  ±20% )
C28 = CC0805JRNPO9BN150: Manufacturer: Yageo; Value: 15; Type: Конденсатор; Dielectric: NPO; Tolerance: ±5%; Voltage: 50 V; CommentDOC: ( CC - 0805 - NPO - 50 V - 15 pF ±5% ); Part Number: CC0805JRNPO9BN150; Units: pF; Case: 0805; Operating Temperature: -55 ... 125 °C; Series: CC; Value+Units: 15 pF; ValueSCH: 15 pF; ( Series - Case - Dielectric -  Voltage - Value+Units Tolerance: ( CC - 0805 - NPO - 50 V - 15 pF ±5% )
FB2-FB5 = BLM21PG221SN1D: Manufacturer: Murata Electronics; Type: Ферритовая бусина; Part Number: BLM21PG221SN1D; Series: EMIFIL; Case: 0805; ValueSCH: BLM21PG221SN1D; Operating Temperature: −55°C ... 125°C
L1 L2 = FHW1210HC047JGT: Manufacturer: FH(Guangdong Fenghua Advanced Tech); Type: Дроссель; Part Number: FHW1210HC047JGT; Series: FHW; Case: 1210; ValueSCH: 47nH
R10 R11 = RC0805JR-0733RL: Manufacturer: Yageo; Power: 0,125 W; Units: Ohm; Tolerance: ±5%; Operating Voltage: 150 V; Value+Units: 33 Ohm; CommentDOC: ( RC - 0805 - 0,125 W - 33 Ohm  ±5% ); Value: 33; Type: Резистор; Part Number: RC0805JR-0733RL; Case: 0805; Operating Temperature: -55°C ... 155°C; ValueSCH: 33; Series: RC
R12-R14 = RC0805JR-071KL: Manufacturer: Yageo; Value: 1; Power: 0,125 W; Units: kOhm; Tolerance: ±5%; Operating Voltage: 150 V; Value+Units: 1 kOhm; CommentDOC: ( RC - 0805 - 0,125 W - 1 kOhm  ±5% ); Type: Резистор; Part Number: RC0805JR-071KL; Case: 0805; Operating Temperature: -55°C ... 155°C; ValueSCH: 1 k; Series: RC
T1 = TC4-1T: Manufacturer: Mini-Circuits; Type: Трансформатор; Part Number: TC4-1T; Case: AT224-1A; Operating Temperature: −20°C ... 85°C
U5 = LTC6400-20: Manufacturer: Analog Devices Inc.; Voltage  Supply: +2,85 V...±3.5 V; Part Number: LTC6400-20; Case: EQFN-16; Operating Temperature: −40°C … 85°C; Type: Микросхема
U6 = AD9226ARSZ: IC ADC 12BIT; Manufacturer: Analog Devices Inc.; Voltage  Supply A/D: 5,0 V/2,85 V … 5,25 V; Part Number: AD9226ARSZ; Function: IC ADC 12BIT; Case: SSOP-28; Operating Temperature: -40°C …  85°C; Type: Микросхема
XG1 = VCXO: Value: 61,44Mhz; Part Number: VCXO; Case: VCXO; Type: Кварцевый генератор

## Sheet WL-FPGA.SchDoc
size 420 x 297 mm; Scale: 1:1; DocumentType: Схема электрическая принципиальная; FirstReferrence: UA3REO/R7KBI; DocumentNumber: 3; SheetNumber: 3; SheetTotal: 12
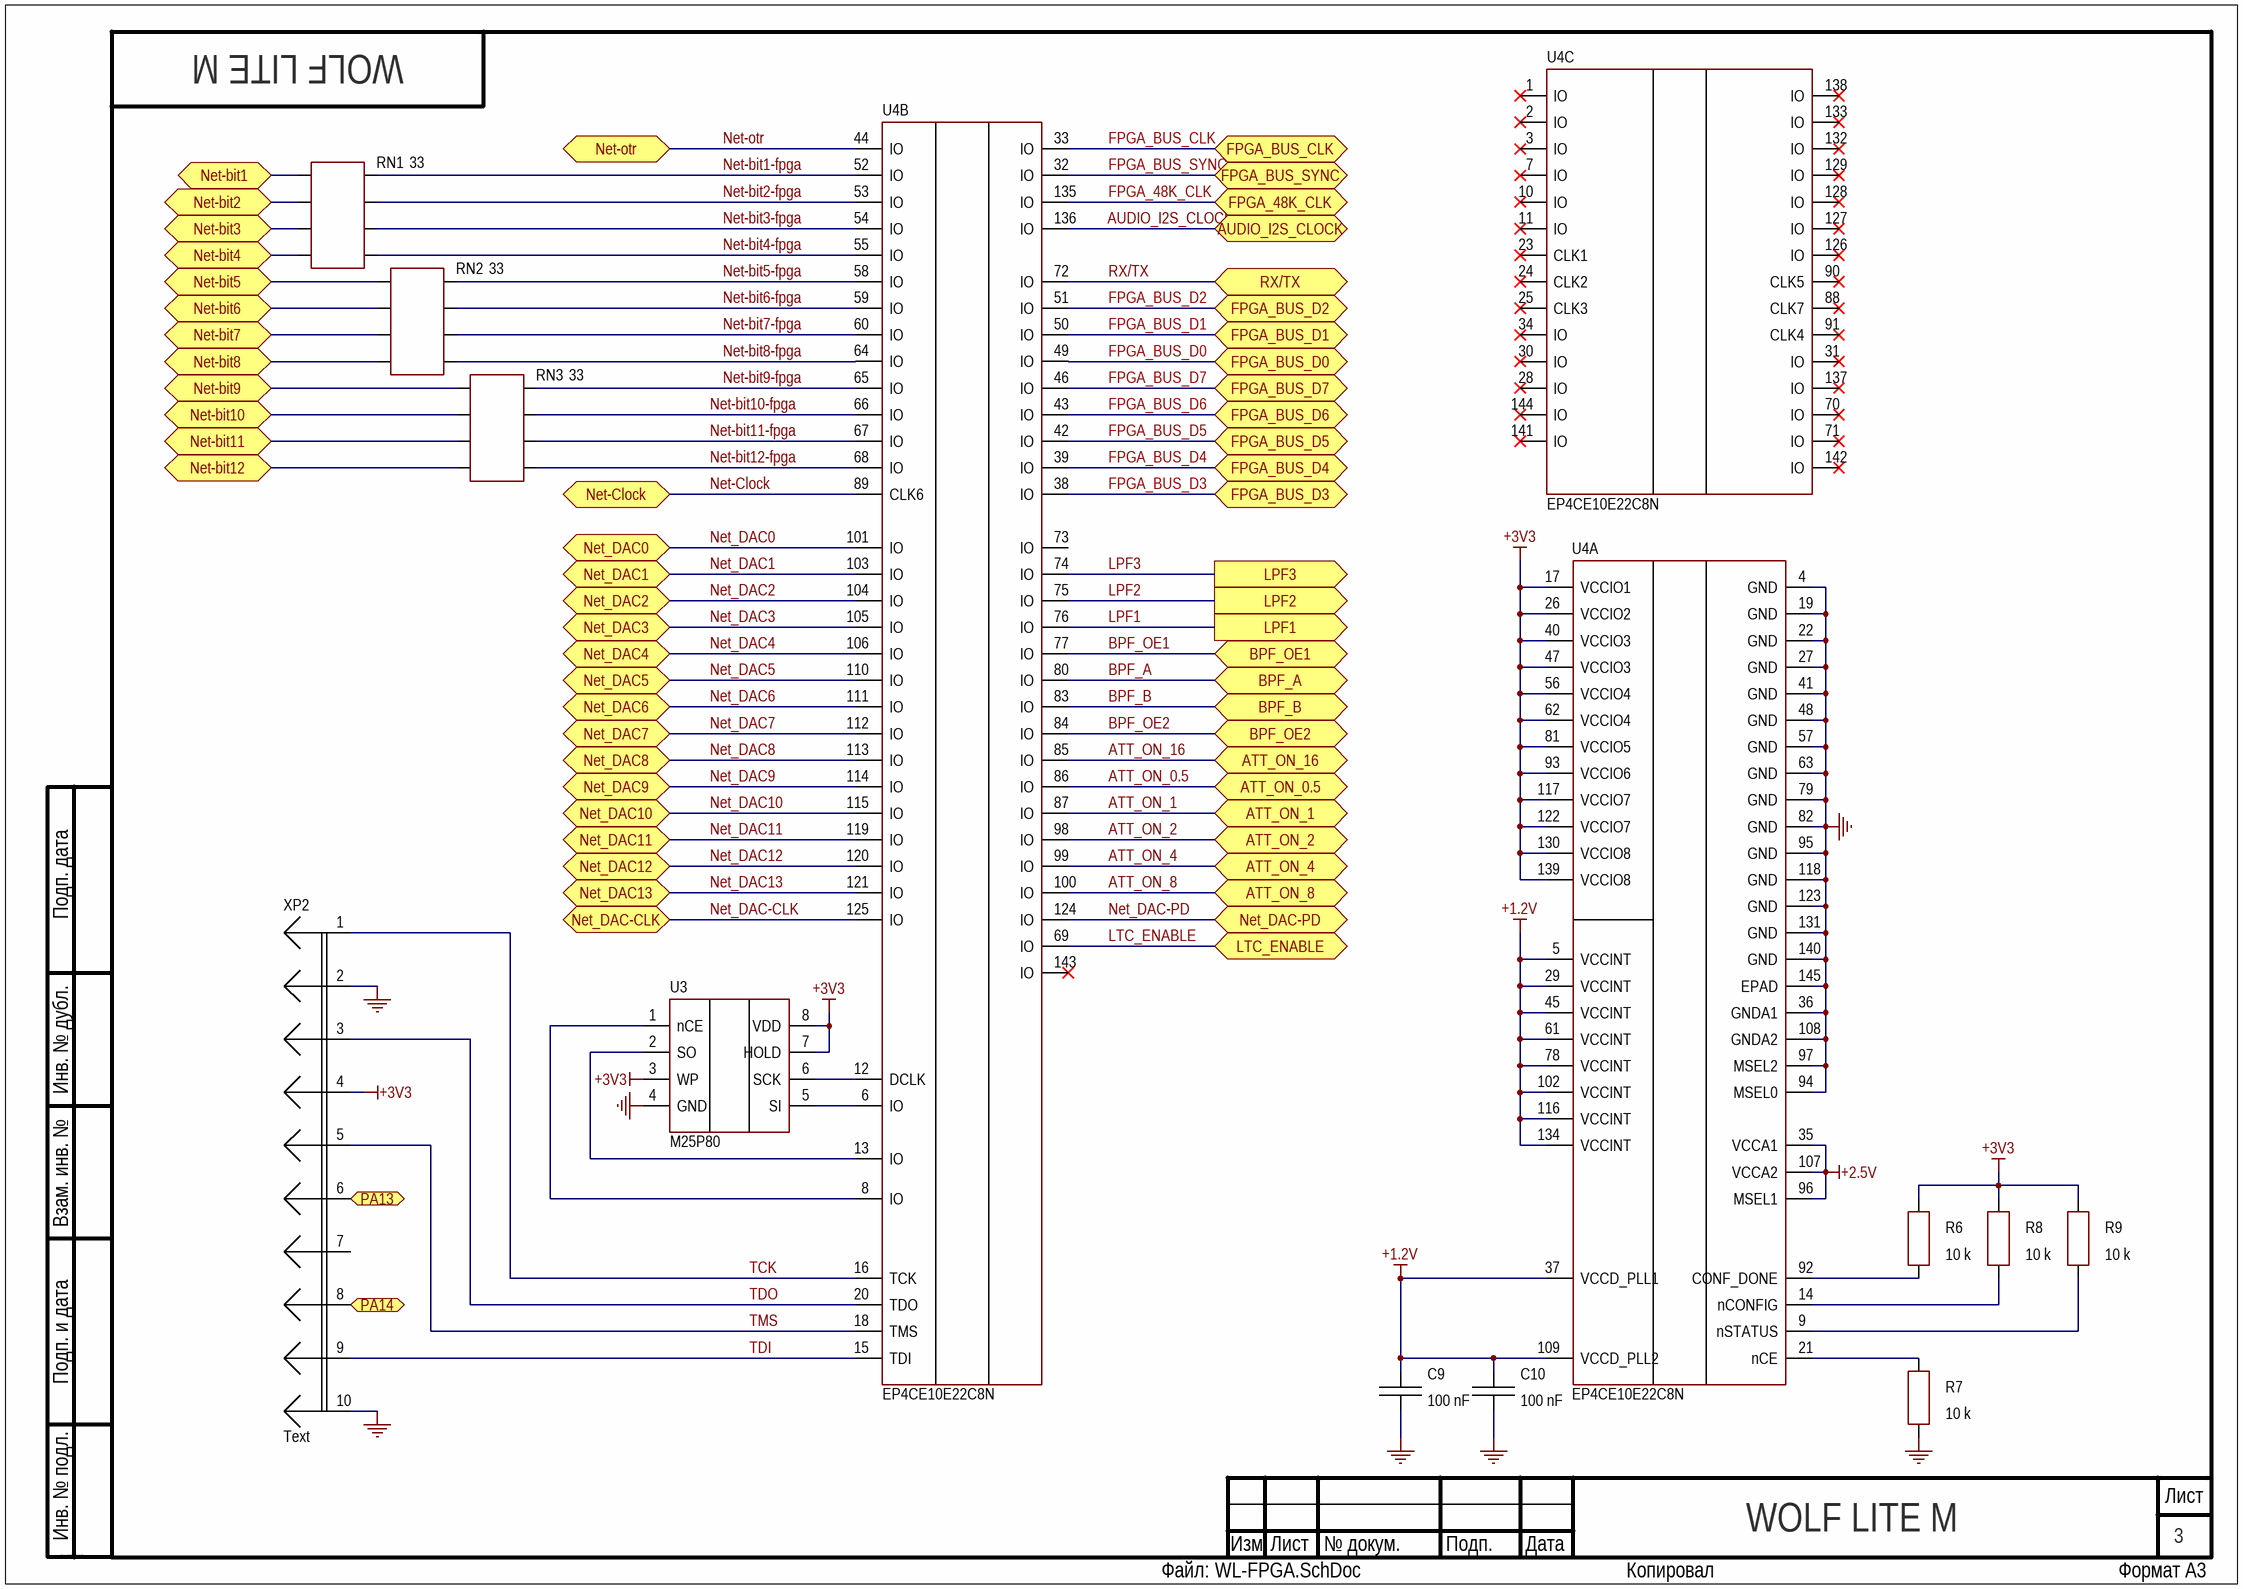
[diagram p3: WL-FPGA.SchDoc]

### Parts
C9  100 nF  [C-0805-0.95]
C10  100 nF  [C-0805-0.95]
R6  10 k  [R-0805]
R7  10 k  [R-0805]
R8  10 k  [R-0805]
R9  10 k  [R-0805]
RN1  33  [RN-1206]
RN2  33  [RN-1206]
RN3  33  [RN-1206]
U3  M25P80  [SOIC-8-W]
U4  EP4CE10E22C8N  [EQFP-144]  (parts A,B,C of 3)
XP2  Text  [PLD-10-JTAG-FPGA-SWD]

### Ports
ATT_ON_0.5 (bidir), ATT_ON_1 (bidir), ATT_ON_2 (bidir), ATT_ON_4 (bidir), ATT_ON_8 (bidir), ATT_ON_16 (bidir), AUDIO_I2S_CLOCK (bidir), BPF_A (bidir), BPF_B (bidir), BPF_OE1 (bidir), BPF_OE2 (bidir), FPGA_48K_CLK (bidir), FPGA_BUS_CLK (bidir), FPGA_BUS_D0 (bidir), FPGA_BUS_D1 (bidir), FPGA_BUS_D2 (bidir), FPGA_BUS_D3 (bidir), FPGA_BUS_D4 (bidir), FPGA_BUS_D5 (bidir), FPGA_BUS_D6 (bidir), FPGA_BUS_D7 (bidir), FPGA_BUS_SYNC (bidir), LPF1 (out), LPF2 (out), LPF3 (out), LTC_ENABLE (bidir), Net-bit1 (bidir), Net-bit2 (bidir), Net-bit3 (bidir), Net-bit4 (bidir), Net-bit5 (bidir), Net-bit6 (bidir), Net-bit7 (bidir), Net-bit8 (bidir), Net-bit9 (bidir), Net-bit10 (bidir), Net-bit11 (bidir), Net-bit12 (bidir), Net-Clock (bidir), Net-otr (bidir), Net_DAC0 (bidir), Net_DAC1 (bidir), Net_DAC2 (bidir), Net_DAC3 (bidir), Net_DAC4 (bidir), Net_DAC5 (bidir), Net_DAC6 (bidir), Net_DAC7 (bidir), Net_DAC8 (bidir), Net_DAC9 (bidir), Net_DAC10 (bidir), Net_DAC11 (bidir), Net_DAC12 (bidir), Net_DAC13 (bidir), Net_DAC-CLK (bidir), Net_DAC-PD (bidir), PA13 (bidir), PA14 (bidir), RX/TX (bidir)

### Nets
+1.2V: C9.2 C10.2 U4.5(VCCINT) U4.29(VCCINT) U4.37(VCCD_PLL1) U4.45(VCCINT) U4.61(VCCINT) U4.78(VCCINT) U4.102(VCCINT) U4.109(VCCD_PLL2) U4.116(VCCINT) U4.134(VCCINT)
+2.5V: U4.35(VCCA1) U4.96(MSEL1) U4.107(VCCA2)
+3V3: R6.1 R8.1 R9.1 U3.3(WP) U3.7(HOLD) U3.8(VDD) U4.17(VCCIO1) U4.26(VCCIO2) U4.40(VCCIO3) U4.47(VCCIO3) U4.56(VCCIO4) U4.62(VCCIO4) U4.81(VCCIO5) U4.93(VCCIO6) U4.117(VCCIO7) U4.122(VCCIO7) U4.130(VCCIO8) U4.139(VCCIO8) XP2.4
GND: C9.1 C10.1 R7.1 U3.4(GND) U4.4(GND) U4.19(GND) U4.22(GND) U4.27(GND) U4.36(GNDA1) U4.41(GND) U4.48(GND) U4.57(GND) U4.63(GND) U4.79(GND) U4.82(GND) U4.94(MSEL0) U4.95(GND) U4.97(MSEL2) U4.108(GNDA2) U4.118(GND) U4.123(GND) U4.131(GND) U4.140(GND) U4.145(EPAD) XP2.2 XP2.10
ATT_ON_0.5: U4.86(IO) ; port ATT_ON_0.5
ATT_ON_1: U4.87(IO) ; port ATT_ON_1
ATT_ON_2: U4.98(IO) ; port ATT_ON_2
ATT_ON_4: U4.99(IO) ; port ATT_ON_4
ATT_ON_8: U4.100(IO) ; port ATT_ON_8
ATT_ON_16: U4.85(IO) ; port ATT_ON_16
AUDIO_I2S_CLOCK: U4.136(IO) ; port AUDIO_I2S_CLOCK
BPF_A: U4.80(IO) ; port BPF_A
BPF_B: U4.83(IO) ; port BPF_B
BPF_OE1: U4.77(IO) ; port BPF_OE1
BPF_OE2: U4.84(IO) ; port BPF_OE2
FPGA_48K_CLK: U4.135(IO) ; port FPGA_48K_CLK
FPGA_BUS_CLK: U4.33(IO) ; port FPGA_BUS_CLK
FPGA_BUS_D0: U4.49(IO) ; port FPGA_BUS_D0
FPGA_BUS_D1: U4.50(IO) ; port FPGA_BUS_D1
FPGA_BUS_D2: U4.51(IO) ; port FPGA_BUS_D2
FPGA_BUS_D3: U4.38(IO) ; port FPGA_BUS_D3
FPGA_BUS_D4: U4.39(IO) ; port FPGA_BUS_D4
FPGA_BUS_D5: U4.42(IO) ; port FPGA_BUS_D5
FPGA_BUS_D6: U4.43(IO) ; port FPGA_BUS_D6
FPGA_BUS_D7: U4.46(IO) ; port FPGA_BUS_D7
FPGA_BUS_SYNC: U4.32(IO) ; port FPGA_BUS_SYNC
LPF1: U4.76(IO) ; port LPF1
LPF2: U4.75(IO) ; port LPF2
LPF3: U4.74(IO) ; port LPF3
LTC_ENABLE: U4.69(IO) ; port LTC_ENABLE
Net-bit1: RN1.1 ; port Net-bit1
Net-bit1-fpga: RN1.8 U4.52(IO)
Net-bit2: RN1.2 ; port Net-bit2
Net-bit2-fpga: RN1.7 U4.53(IO)
Net-bit3: RN1.3 ; port Net-bit3
Net-bit3-fpga: RN1.6 U4.54(IO)
Net-bit4: RN1.4 ; port Net-bit4
Net-bit4-fpga: RN1.5 U4.55(IO)
Net-bit5: RN2.1 ; port Net-bit5
Net-bit5-fpga: RN2.8 U4.58(IO)
Net-bit6: RN2.2 ; port Net-bit6
Net-bit6-fpga: RN2.7 U4.59(IO)
Net-bit7: RN2.3 ; port Net-bit7
Net-bit7-fpga: RN2.6 U4.60(IO)
Net-bit8: RN2.4 ; port Net-bit8
Net-bit8-fpga: RN2.5 U4.64(IO)
Net-bit9: RN3.1 ; port Net-bit9
Net-bit9-fpga: RN3.8 U4.65(IO)
Net-bit10: RN3.2 ; port Net-bit10
Net-bit10-fpga: RN3.7 U4.66(IO)
Net-bit11: RN3.3 ; port Net-bit11
Net-bit11-fpga: RN3.6 U4.67(IO)
Net-bit12: RN3.4 ; port Net-bit12
Net-bit12-fpga: RN3.5 U4.68(IO)
Net-Clock: U4.89(CLK6) ; port Net-Clock
Net-otr: U4.44(IO) ; port Net-otr
Net_DAC0: U4.101(IO) ; port Net_DAC0
Net_DAC1: U4.103(IO) ; port Net_DAC1
Net_DAC2: U4.104(IO) ; port Net_DAC2
Net_DAC3: U4.105(IO) ; port Net_DAC3
Net_DAC4: U4.106(IO) ; port Net_DAC4
Net_DAC5: U4.110(IO) ; port Net_DAC5
Net_DAC6: U4.111(IO) ; port Net_DAC6
Net_DAC7: U4.112(IO) ; port Net_DAC7
Net_DAC8: U4.113(IO) ; port Net_DAC8
Net_DAC9: U4.114(IO) ; port Net_DAC9
Net_DAC10: U4.115(IO) ; port Net_DAC10
Net_DAC11: U4.119(IO) ; port Net_DAC11
Net_DAC12: U4.120(IO) ; port Net_DAC12
Net_DAC13: U4.121(IO) ; port Net_DAC13
Net_DAC-CLK: U4.125(IO) ; port Net_DAC-CLK
Net_DAC-PD: U4.124(IO) ; port Net_DAC-PD
PA13: XP2.6 ; port PA13
PA14: XP2.8 ; port PA14
RX/TX: U4.72(IO) ; port RX/TX
TCK: U4.16(TCK) XP2.1
TDI: U4.15(TDI) XP2.9
TDO: U4.20(TDO) XP2.3
TMS: U4.18(TMS) XP2.5
NetR6_2: R6.2 U4.92(CONF_DONE)
NetR7_2: R7.2 U4.21(nCE)
NetR8_2: R8.2 U4.14(nCONFIG)
NetR9_2: R9.2 U4.9(nSTATUS)
NetU3_1: U3.1(nCE) U4.8(IO)
NetU3_2: U3.2(SO) U4.13(IO)
NetU3_5: U3.5(SI) U4.6(IO)
NetU3_6: U3.6(SCK) U4.12(DCLK)

Not connected (* = marked no-connect by the designer): U4 1(IO)* 2(IO)* 3(IO)* 7(IO)* 10(IO)* 11(IO)* 23(CLK1)* 24(CLK2)* 25(CLK3)* 28(IO)* 30(IO)* 31(IO)* 34(IO)* 70(IO)* 71(IO)* 73(IO) 88(CLK7)* 90(CLK5)* 91(CLK4)* 126(IO)* 127(IO)* 128(IO)* 129(IO)* 132(IO)* 133(IO)* 137(IO)* 138(IO)* 141(IO)* 142(IO)* 143(IO)* 144(IO)*; XP2 7

### Notes on the sheet
- Подп. дата
- Инв. № дубл.
- Взам. инв. №
- Подп. и дата
- Инв. № подл.
- Изм.
- Лист
- № докум.
- Подп.
- Дата
- ALTIUM GOSTBOM2.0 KEV
- Файл:
- Копировал
- Формат А3

### Library data of the parts
C9 C10 = CC0805KRX7R9BB104: as C81 on sheet WL-POWER; Part Number: CC0805KRX7R9BB104; Units: nF; Case: 0805; Operating Temperature: -55 ... 125 °C; Series: CC; Value+Units: 100 nF; ValueSCH: 100 nF; ( Series - Case - Dielectric -  Voltage - Value+Units Tolerance: ( CC - 0805 - X7R - 50 V - 100 nF ±10% )
R6-R9 = RC0805JR-0710KL: as R47 on sheet WL-POWER; Type: Резистор; Part Number: RC0805JR-0710KL; Case: 0805; Operating Temperature: -55°C ... 155°C; ValueSCH: 10 k; Series: RC
RN1-RN3 = YC164-JR-0733RL: Manufacturer: Yageo; Power: 1/16W; Units: Ohm; Tolerance: ±5%; Value+Units: 33 Ohm; Type: Резистивная сборка; Part Number: YC164-JR-0733RL; Value: 33; Case: 1206; Operating Temperature: -55°C ... 155°C; ValueSCH: 33; Series: YC164
U3 = M25P80-VMW6: IC FLASH 8MBIT SPI 75MHZ; Manufacturer: Micron Technology Inc.; Voltage  Supply: +2,7 V … 3,6 V; Part Number: M25P80-VMW6; ValueSCH: M25P80; Function: IC FLASH 8MBIT SPI 75MHZ; Case: SOIC-8-W; Operating Temperature: -40°С ... 85°С; Type: Микросхема
U4 = EP4CE10E22C8N: Manufacturer: Intel; Function: IC FPGA 91 I/O; Voltage  Supply: 1.15V … 1.25V; Part Number: EP4CE10E22C8N; Case: EQFP-144; Operating Temperature: 0°C …  85°C; Type: Микросхема
XP2 = PLD-10: Part Number: PLD-10; Pitch: 2,54 mm; Type: Вилка; Number of Pins: 10

## Sheet WL-DAC.SchDoc
size 420 x 297 mm; Scale: 1:1; DocumentType: Схема электрическая принципиальная; FirstReferrence: UA3REO/R7KBI; DocumentNumber: 5; SheetNumber: 5; SheetTotal: 12
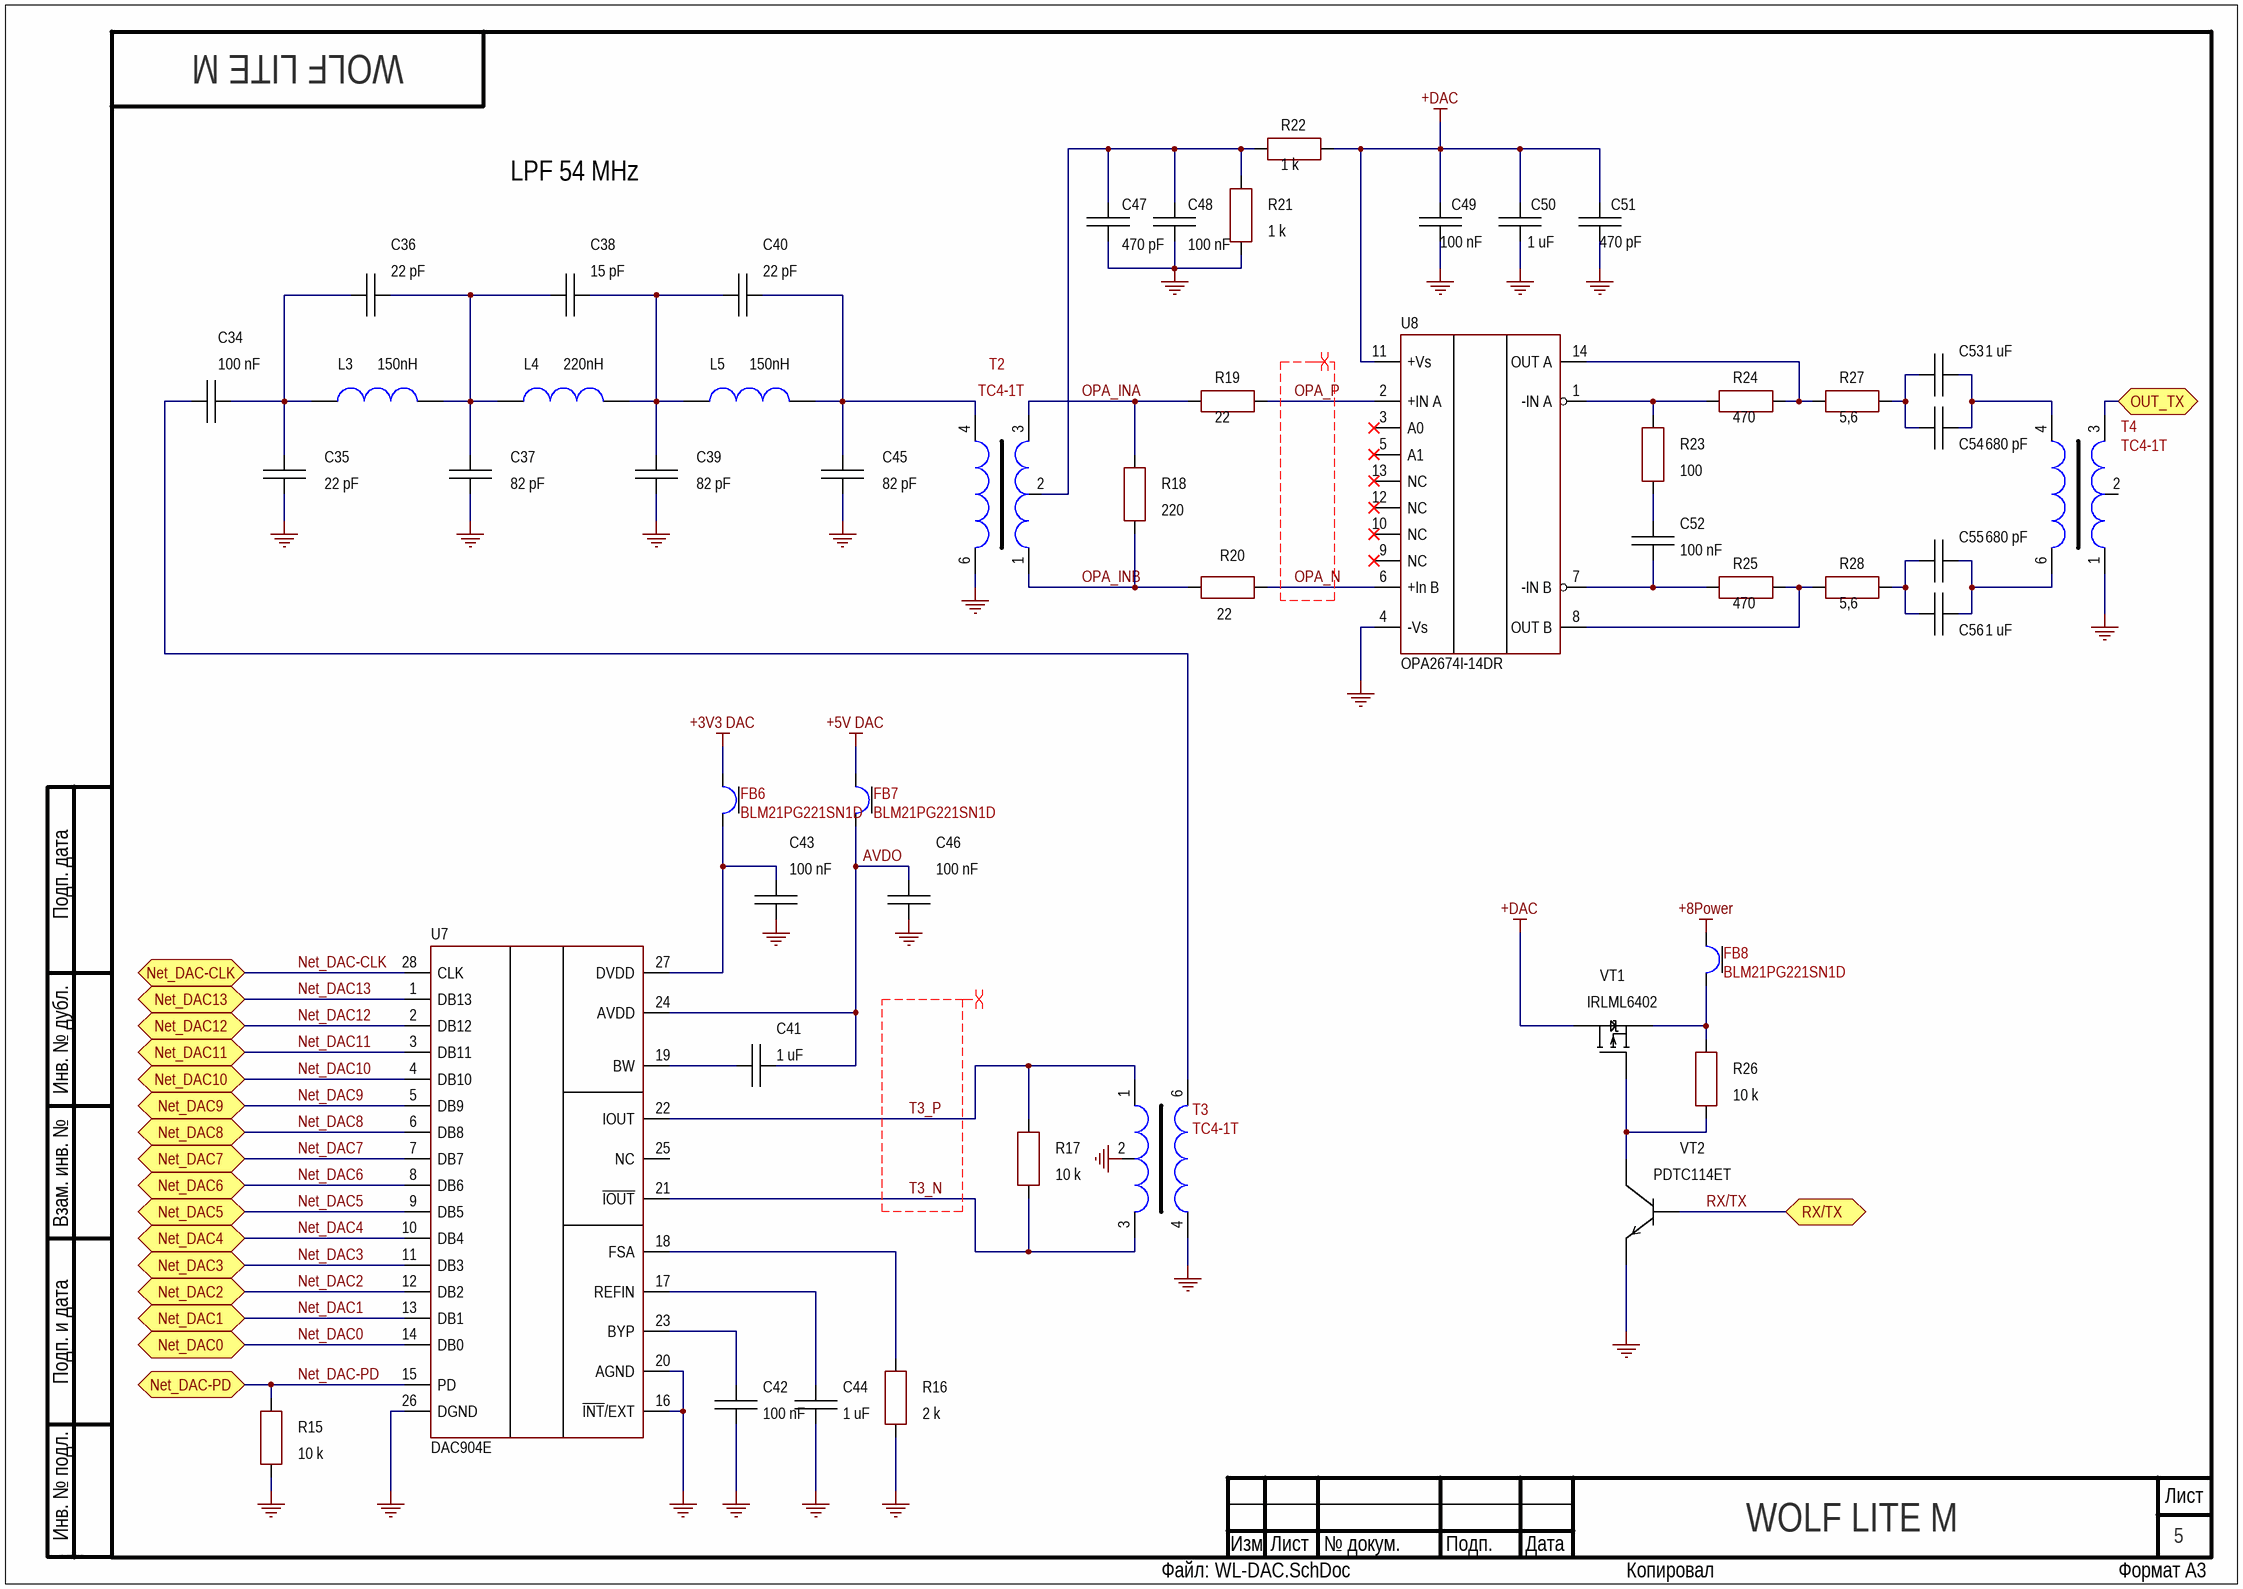
[diagram p4: WL-DAC.SchDoc]

### Parts
C34  100 nF  [C-0805-0.95]
C35  22 pF  [C-0805-0.7]
C36  22 pF  [C-0805-0.7]
C37  82 pF  [C-0805-0.7]
C38  15 pF  [C-0805-0.7]
C39  82 pF  [C-0805-0.7]
C40  22 pF  [C-0805-0.7]
C41  1 uF  [C-0805-1.25]
C42  100 nF  [C-0805-0.95]
C43  100 nF  [C-0805-0.95]
C44  1 uF  [C-0805-1.25]
C45  82 pF  [C-0805-0.7]
C46  100 nF  [C-0805-0.95]
C47  470 pF  [C-0805-0.7]
C48  100 nF  [C-0805-0.95]
C49  100 nF  [C-0805-0.95]
C50  1 uF  [C-0805-1.25]
C51  470 pF  [C-0805-0.7]
C52  100 nF  [C-0805-0.95]
C53  1 uF  [C-0805-1.25]
C54  680 pF  [C-0805-0.7]
C55  680 pF  [C-0805-0.7]
C56  1 uF  [C-0805-1.25]
FB6  BLM21PG221SN1D  [L-0805]
FB7  BLM21PG221SN1D  [L-0805]
FB8  BLM21PG221SN1D  [L-0805]
L3  150nH  [L-1210]
L4  220nH  [L-1210]
L5  150nH  [L-1210]
R15  10 k  [R-0805]
R16  2 k  [R-0805]
R17  10 k  [R-0805]
R18  220  [R-0805]
R19  22  [R-0805]
R20  22  [R-0805]
R21  1 k  [R-0805]
R22  1 k  [R-0805]
R23  100  [R-0805]
R24  470  [R-0805]
R25  470  [R-0805]
R26  10 k  [R-0805]
R27  5,6  [R-0805]
R28  5,6  [R-0805]
T2  TC4-1T  [TC4-1T]
T3  TC4-1T  [TC4-1T]
T4  TC4-1T  [TC4-1T]
U7  DAC904E  [TSSOP-28]
U8  OPA2674I-14DR  [SOIC-14]
VT1  IRLML6402  [SOT-23]
VT2  PDTC114ET  [SOT-23]

### Ports
Net_DAC0 (bidir), Net_DAC1 (bidir), Net_DAC2 (bidir), Net_DAC3 (bidir), Net_DAC4 (bidir), Net_DAC5 (bidir), Net_DAC6 (bidir), Net_DAC7 (bidir), Net_DAC8 (bidir), Net_DAC9 (bidir), Net_DAC10 (bidir), Net_DAC11 (bidir), Net_DAC12 (bidir), Net_DAC13 (bidir), Net_DAC-CLK (bidir), Net_DAC-PD (bidir), OUT_TX (bidir), RX/TX (bidir)

### Nets
+3V3 DAC: FB6.2
+5V DAC: FB7.2
+8Power: FB8.2
+DAC: C49.1 C50.1 C51.1 R22.1 U8.11(+Vs) VT1.3(D)
GND: C35.1 C37.1 C39.1 C42.2 C43.2 C44.2 C45.1 C46.2 C47.1 C48.1 C49.2 C50.2 C51.2 R15.1 R16.1 R21.2 T2.6 T3.2 T3.4 T4.1 U7.16(~{INT}/EXT) U7.20(AGND) U7.26(DGND) U8.4(-Vs) VT2.2
AVDO: C41.2 C46.1 FB7.1 U7.24(AVDD)
Net_DAC0: U7.14(DB0) ; port Net_DAC0
Net_DAC1: U7.13(DB1) ; port Net_DAC1
Net_DAC2: U7.12(DB2) ; port Net_DAC2
Net_DAC3: U7.11(DB3) ; port Net_DAC3
Net_DAC4: U7.10(DB4) ; port Net_DAC4
Net_DAC5: U7.9(DB5) ; port Net_DAC5
Net_DAC6: U7.8(DB6) ; port Net_DAC6
Net_DAC7: U7.7(DB7) ; port Net_DAC7
Net_DAC8: U7.6(DB8) ; port Net_DAC8
Net_DAC9: U7.5(DB9) ; port Net_DAC9
Net_DAC10: U7.4(DB10) ; port Net_DAC10
Net_DAC11: U7.3(DB11) ; port Net_DAC11
Net_DAC12: U7.2(DB12) ; port Net_DAC12
Net_DAC13: U7.1(DB13) ; port Net_DAC13
Net_DAC-CLK: U7.28(CLK) ; port Net_DAC-CLK
Net_DAC-PD: R15.2 U7.15(PD) ; port Net_DAC-PD
OPA_INA: R18.1 R19.1 T2.3
OPA_INB: R18.2 R20.1 T2.1
OPA_N: R20.2 U8.6(+In_B)
OPA_P: R19.2 U8.2(+IN_A)
RX/TX: VT2.1 ; port RX/TX
T3_N: R17.2 T3.3 U7.21(~{IOUT})
T3_P: R17.1 T3.1 U7.22(IOUT)
NetC34_1: C34.1 T3.6
NetC34_2: C34.2 C35.2 C36.1 L3.1
NetC36_2: C36.2 C37.2 C38.1 L3.2 L4.1
NetC38_2: C38.2 C39.2 C40.1 L4.2 L5.1
NetC40_2: C40.2 C45.2 L5.2 T2.4
NetC41_1: C41.1 U7.19(BW)
NetC42_1: C42.1 U7.23(BYP)
NetC43_1: C43.1 FB6.1 U7.27(DVDD)
NetC44_1: C44.1 U7.17(REFIN)
NetC47_2: C47.2 C48.2 R21.1 R22.2 T2.2
NetC52_1: C52.1 R23.1
NetC52_2: C52.2 R25.1 U8.7(-IN_B)
NetC53_1: C53.1 C54.1 R27.2
NetC53_2: C53.2 C54.2 T4.4
NetC55_1: C55.1 C56.1 R28.2
NetC55_2: C55.2 C56.2 T4.6
NetFB8_1: FB8.1 R26.2 VT1.2(S)
NetR16_2: R16.2 U7.18(FSA)
NetR23_2: R23.2 R24.1 U8.1(-IN_A)
NetR24_2: R24.2 R27.1 U8.14(OUT_A)
NetR25_2: R25.2 R28.1 U8.8(OUT_B)
NetR26_1: R26.1 VT1.1(G) VT2.3
NetT4_3: T4.3 ; port OUT_TX

Not connected (* = marked no-connect by the designer): T4 2; U7 25(NC); U8 3(A0)* 5(A1)* 9(NC)* 10(NC)* 12(NC)* 13(NC)*

### Layout directives
differential pair: OPA_N, OPA_P, T3_N, T3_P

### Notes on the sheet
- LPF 54 MHz
- Подп. дата
- Инв. № дубл.
- Взам. инв. №
- Подп. и дата
- Инв. № подл.
- Изм.
- Лист
- № докум.
- Подп.
- Дата
- ALTIUM GOSTBOM2.0 KEV
- Файл:
- Копировал
- Формат А3

### Library data of the parts
C34 C42 C43 C46 C48 C49 C52 = CC0805KRX7R9BB104: as C81 on sheet WL-POWER; Part Number: CC0805KRX7R9BB104; Units: nF; Case: 0805; Operating Temperature: -55 ... 125 °C; Series: CC; Value+Units: 100 nF; ValueSCH: 100 nF; ( Series - Case - Dielectric -  Voltage - Value+Units Tolerance: ( CC - 0805 - X7R - 50 V - 100 nF ±10% )
C35 C36 C40 = CC0805JRNPO9BN220: Manufacturer: Yageo; Value: 22; Type: Конденсатор; Dielectric: NPO; Tolerance: ±5%; Voltage: 50 V; CommentDOC: ( CC - 0805 - NPO - 50 V - 22 pF ±5% ); Part Number: CC0805JRNPO9BN220; Units: pF; Case: 0805; Operating Temperature: -55 ... 125 °C; Series: CC; Value+Units: 22 pF; ValueSCH: 22 pF; ( Series - Case - Dielectric -  Voltage - Value+Units Tolerance: ( CC - 0805 - NPO - 50 V - 22 pF ±5% )
C37 C39 C45 = CC0805JRNPO9BN820: Manufacturer: Yageo; Value: 82; Type: Конденсатор; Dielectric: NPO; Tolerance: ±5%; Voltage: 50 V; CommentDOC: ( CC - 0805 - NPO - 50 V - 82 pF ±5% ); Part Number: CC0805JRNPO9BN820; Units: pF; Case: 0805; Operating Temperature: -55 ... 125 °C; Series: CC; Value+Units: 82 pF; ValueSCH: 82 pF; ( Series - Case - Dielectric -  Voltage - Value+Units Tolerance: ( CC - 0805 - NPO - 50 V - 82 pF ±5% )
C38 = CC0805JRNPO9BN150: as C28 on sheet WL-ADC; Part Number: CC0805JRNPO9BN150; Units: pF; Case: 0805; Operating Temperature: -55 ... 125 °C; Series: CC; Value+Units: 15 pF; ValueSCH: 15 pF; ( Series - Case - Dielectric -  Voltage - Value+Units Tolerance: ( CC - 0805 - NPO - 50 V - 15 pF ±5% )
C41 C44 C50 C53 C56 = CC0805KKX7R9BB105: as C15 on sheet WL-ADC; Part Number: CC0805KKX7R9BB105; Units: uF; Case: 0805; Operating Temperature: -55 ... 125 °C; Series: CC; Value+Units: 1 uF; ValueSCH: 1 uF; ( Series - Case - Dielectric -  Voltage - Value+Units Tolerance: ( CC - 0805 - X7R - 50 V - 1 uF ±10% )
C47 C51 = CC0805JRNPO9BN471: as C13 on sheet WL-ADC; Part Number: CC0805JRNPO9BN471; Units: pF; Case: 0805; Operating Temperature: -55 ... 125 °C; Series: CC; Value+Units: 470 pF; ValueSCH: 470 pF; ( Series - Case - Dielectric -  Voltage - Value+Units Tolerance: ( CC - 0805 - NPO - 50 V - 470 pF ±5% )
C54 C55 = CC0805JRNPO9BN681: Manufacturer: Yageo; Value: 680; Type: Конденсатор; Dielectric: NPO; Tolerance: ±5%; Voltage: 50 V; CommentDOC: ( CC - 0805 - NPO - 50 V - 680 pF ±5% ); Part Number: CC0805JRNPO9BN681; Units: pF; Case: 0805; Operating Temperature: -55 ... 125 °C; Series: CC; Value+Units: 680 pF; ValueSCH: 680 pF; ( Series - Case - Dielectric -  Voltage - Value+Units Tolerance: ( CC - 0805 - NPO - 50 V - 680 pF ±5% )
FB6-FB8 = BLM21PG221SN1D: as FB2 on sheet WL-ADC; Part Number: BLM21PG221SN1D; Series: EMIFIL; Case: 0805; ValueSCH: BLM21PG221SN1D; Operating Temperature: −55°C ... 125°C
L3 L5 = FHW1210HCR15JGT: Manufacturer: FH(Guangdong Fenghua Advanced Tech); Type: Дроссель; Part Number: FHW1210HCR15JGT; Series: FHW; Case: 1210; ValueSCH: 150nH
L4 = FHW1210HCR22JGT: Manufacturer: FH(Guangdong Fenghua Advanced Tech); Type: Дроссель; Part Number: FHW1210HCR22JGT; Series: FHW; Case: 1210; ValueSCH: 220nH
R15 R17 R26 = RC0805JR-0710KL: as R47 on sheet WL-POWER; Type: Резистор; Part Number: RC0805JR-0710KL; Case: 0805; Operating Temperature: -55°C ... 155°C; ValueSCH: 10 k; Series: RC
R16 = RC0805JR-072KL: Manufacturer: Yageo; Value: 2; Power: 0,125 W; Units: kOhm; Tolerance: ±5%; Operating Voltage: 150 V; Value+Units: 2 kOhm; CommentDOC: ( RC - 0805 - 0,125 W - 2 kOhm  ±5% ); Type: Резистор; Part Number: RC0805JR-072KL; Case: 0805; Operating Temperature: -55°C ... 155°C; ValueSCH: 2 k; Series: RC
R18 = RC0805JR-07220RL: Manufacturer: Yageo; Power: 0,125 W; Units: Ohm; Tolerance: ±5%; Operating Voltage: 150 V; Value+Units: 220 Ohm; CommentDOC: ( RC - 0805 - 0,125 W - 220 Ohm  ±5% ); Value: 220; Type: Резистор; Part Number: RC0805JR-07220RL; Case: 0805; Operating Temperature: -55°C ... 155°C; ValueSCH: 220; Series: RC
R19 R20 = RC0805JR-0722RL: Manufacturer: Yageo; Power: 0,125 W; Units: Ohm; Tolerance: ±5%; Operating Voltage: 150 V; Value+Units: 22 Ohm; CommentDOC: ( RC - 0805 - 0,125 W - 22 Ohm  ±5% ); Value: 22; Type: Резистор; Part Number: RC0805JR-0722RL; Case: 0805; Operating Temperature: -55°C ... 155°C; ValueSCH: 22; Series: RC
R21 R22 = RC0805JR-071KL: as R12 on sheet WL-ADC; Type: Резистор; Part Number: RC0805JR-071KL; Case: 0805; Operating Temperature: -55°C ... 155°C; ValueSCH: 1 k; Series: RC
R23 = RC0805JR-07100RL: Manufacturer: Yageo; Power: 0,125 W; Units: Ohm; Tolerance: ±5%; Operating Voltage: 150 V; Value+Units: 100 Ohm; CommentDOC: ( RC - 0805 - 0,125 W - 100 Ohm  ±5% ); Value: 100; Type: Резистор; Part Number: RC0805JR-07100RL; Case: 0805; Operating Temperature: -55°C ... 155°C; ValueSCH: 100; Series: RC
R24 R25 = RC0805JR-07470RL: Manufacturer: Yageo; Power: 0,125 W; Units: Ohm; Tolerance: ±5%; Operating Voltage: 150 V; Value+Units: 470 Ohm; CommentDOC: ( RC - 0805 - 0,125 W - 470 Ohm  ±5% ); Value: 470; Type: Резистор; Part Number: RC0805JR-07470RL; Case: 0805; Operating Temperature: -55°C ... 155°C; ValueSCH: 470; Series: RC
R27 R28 = RC0805JR-075R6L: Manufacturer: Yageo; Power: 0,125 W; Units: Ohm; Tolerance: ±5%; Operating Voltage: 150 V; Value+Units: 5,6 Ohm; CommentDOC: ( RC - 0805 - 0,125 W - 5,6 Ohm  ±5% ); Value: 5,6; Type: Резистор; Part Number: RC0805JR-075R6L; Case: 0805; Operating Temperature: -55°C ... 155°C; ValueSCH: 5,6; Series: RC
T2-T4 = TC4-1T: as T1 on sheet WL-ADC; Part Number: TC4-1T; Case: AT224-1A; Operating Temperature: −20°C ... 85°C
U7 = DAC904E: IC DAC 14BIT; Manufacturer: Texas Instruments; Voltage  Supply A/D: 2,7 V … 5,5 V; Part Number: DAC904E; Function: IC DAC 14BIT; Case: TSSOP-28; Operating Temperature: -40°C …  85°C; Type: Микросхема
U8 = OPA2674I-14DR: IC OPAMP CFA 2 CIRCUIT; Manufacturer: Texas Instruments; Voltage  Supply: +5 V...12 V / '+2,5 V...±6 V; Part Number: OPA2674I-14DR; Case: SOIC-14; Operating Temperature: −40°C … 85°C; Type: Микросхема
VT1 = IRLML6402TRPBF: as VT5 on sheet WL-POWER; Part Number: IRLML6402TRPBF; ValueSCH: IRLML6402; Operating Temperature: -55°C ... 150°C
VT2 = PDTC114ET,215: as VT6 on sheet WL-POWER; Part Number: PDTC114ET,215; ValueSCH: PDTC114ET; Operating Temperature: -65°C …  150°C; DC Current Gain: -

## Sheet WL-ATT.SchDoc
size 420 x 297 mm; Scale: 1:1; DocumentType: Схема электрическая принципиальная; FirstReferrence: UA3REO/R7KBI; DocumentNumber: 7; SheetNumber: 10; SheetTotal: 12
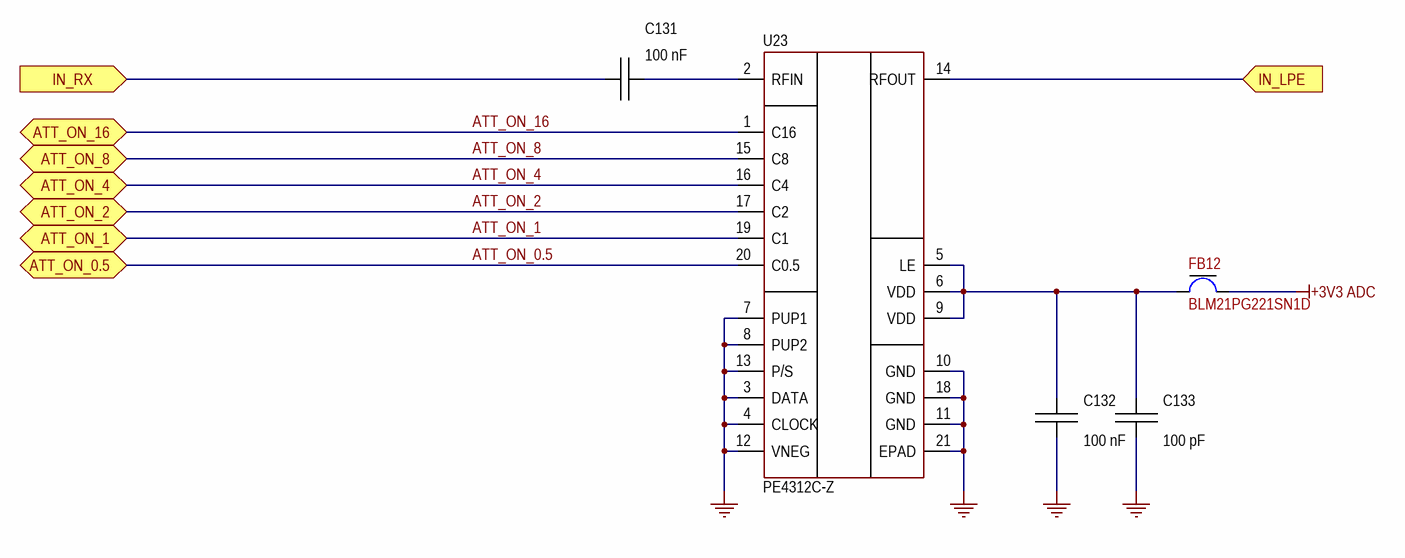
[diagram p5: WL-ATT.SchDoc]

### Parts
C131  100 nF  [C-0805-0.95]
C132  100 nF  [C-0805-0.95]
C133  100 pF  [C-0805-0.7]
FB12  BLM21PG221SN1D  [L-0805]
U23  PE4312C-Z  [QFN-20]

### Ports
ATT_ON_0.5 (bidir), ATT_ON_1 (bidir), ATT_ON_2 (bidir), ATT_ON_4 (bidir), ATT_ON_8 (bidir), ATT_ON_16 (bidir), IN_LPE (in), IN_RX (in)

### Nets
+3V3 ADC: FB12.2
GND: C132.1 C133.1 U23.3(DATA) U23.4(CLOCK) U23.7(PUP1) U23.8(PUP2) U23.10(GND) U23.11(GND) U23.12(VNEG) U23.13(P/S) U23.18(GND) U23.21(EPAD)
ATT_ON_0.5: U23.20(C0.5) ; port ATT_ON_0.5
ATT_ON_1: U23.19(C1) ; port ATT_ON_1
ATT_ON_2: U23.17(C2) ; port ATT_ON_2
ATT_ON_4: U23.16(C4) ; port ATT_ON_4
ATT_ON_8: U23.15(C8) ; port ATT_ON_8
ATT_ON_16: U23.1(C16) ; port ATT_ON_16
IN_LPE: U23.14(RFOUT) ; port IN_LPE
NetC131_1: C131.1 ; port IN_RX
NetC131_2: C131.2 U23.2(RFIN)
NetC132_2: C132.2 C133.2 FB12.1 U23.5(LE) U23.6(VDD) U23.9(VDD)

### Notes on the sheet
- Подп. дата
- Инв. № дубл.
- Взам. инв. №
- Подп. и дата
- Инв. № подл.
- Изм.
- Лист
- № докум.
- Подп.
- Дата
- ALTIUM GOSTBOM2.0 KEV
- Файл:
- Копировал
- Формат А3

### Library data of the parts
C131 C132 = CC0805KRX7R9BB104: as C81 on sheet WL-POWER; Part Number: CC0805KRX7R9BB104; Units: nF; Case: 0805; Operating Temperature: -55 ... 125 °C; Series: CC; Value+Units: 100 nF; ValueSCH: 100 nF; ( Series - Case - Dielectric -  Voltage - Value+Units Tolerance: ( CC - 0805 - X7R - 50 V - 100 nF ±10% )
C133 = CC0805JRNPO9BN101: Manufacturer: Yageo; Value: 100; Type: Конденсатор; Dielectric: NPO; Tolerance: ±5%; Voltage: 50 V; CommentDOC: ( CC - 0805 - NPO - 50 V - 100 pF ±5% ); Part Number: CC0805JRNPO9BN101; Units: pF; Case: 0805; Operating Temperature: -55 ... 125 °C; Series: CC; Value+Units: 100 pF; ValueSCH: 100 pF; ( Series - Case - Dielectric -  Voltage - Value+Units Tolerance: ( CC - 0805 - NPO - 50 V - 100 pF ±5% )
FB12 = BLM21PG221SN1D: as FB2 on sheet WL-ADC; Part Number: BLM21PG221SN1D; Series: EMIFIL; Case: 0805; ValueSCH: BLM21PG221SN1D; Operating Temperature: −55°C ... 125°C
U23 = PE4312C-Z: RF ATTENUATOR 31.5DB 50 OHM; Manufacturer: pSemi; Voltage  Supply: +2,3 V...±5.5 V; Part Number: PE4312C-Z; Function: RF ATTENUATOR 31.5DB 50 OHM; Case: QFN-20; Operating Temperature: -55 ... 105 °C; Type: Микросхема